# Altium project DPPXHKV1_2.PRJPCB
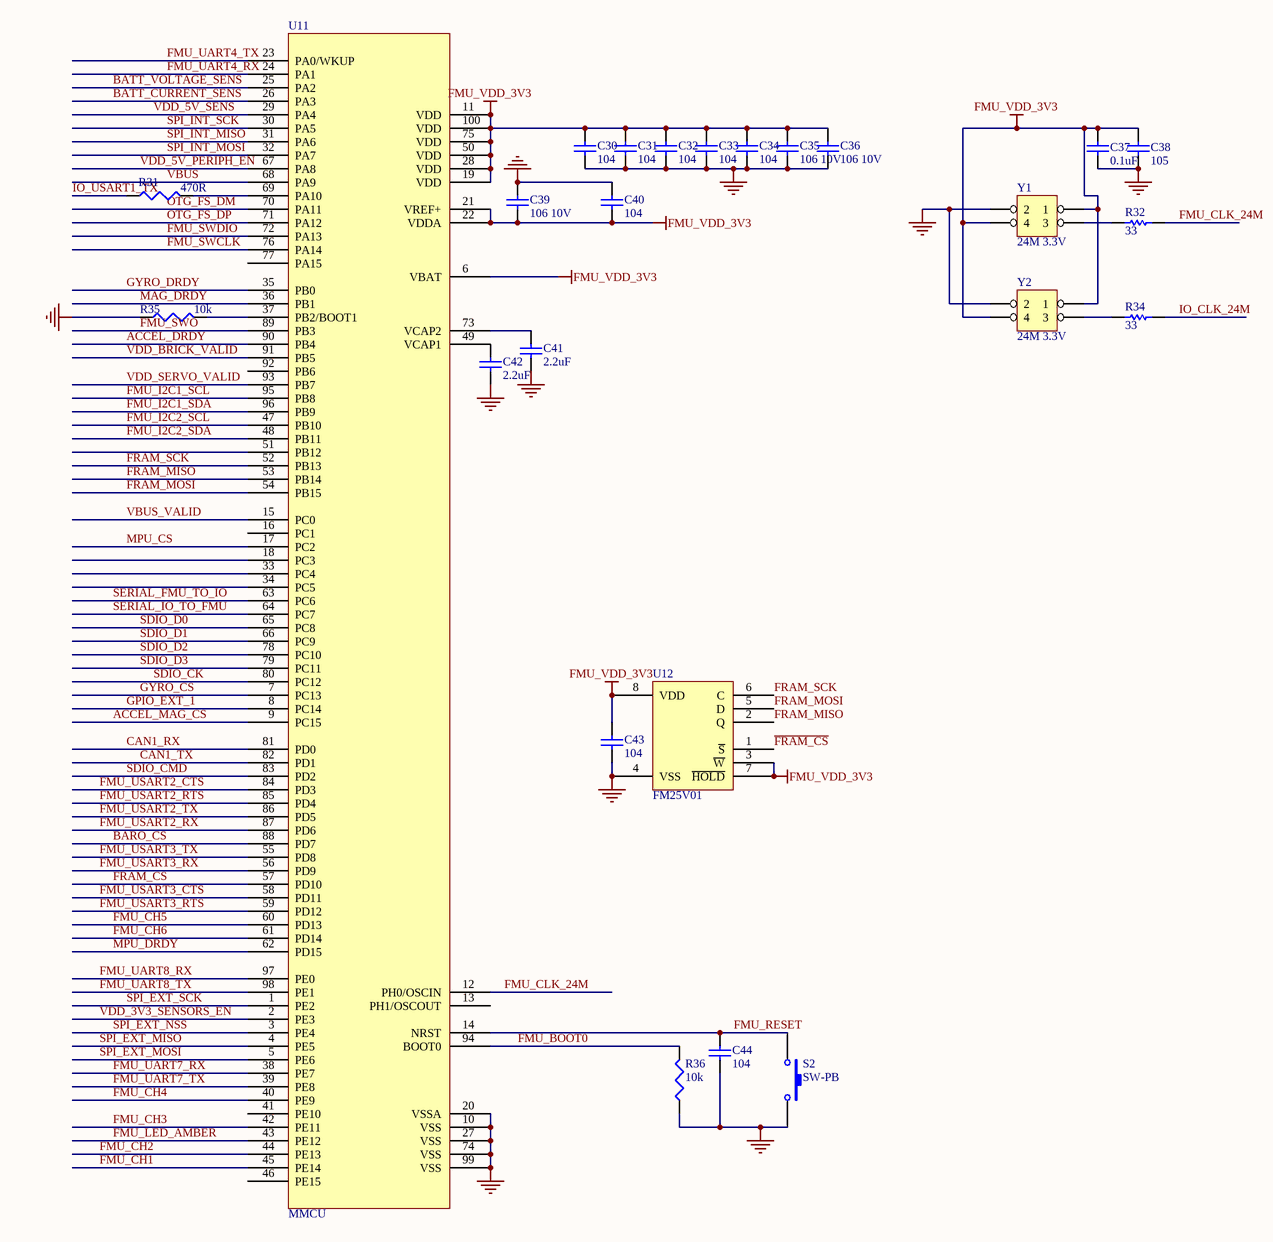
[diagram p0: DPPXHK_MCU.SchDoc]
14 sheets, 169 parts. Net scope: global (net labels, ports and power ports of the same name join across sheets).
Board file: DPPXHK.PcbDoc
Sheets:
  DPPXHK_MCU.SchDoc
  DPPXHK_IO.SCHDOC
  DPPXHK_FMUPOWER.SCHDOC
  DPPXHK_POWER_SOURCE.SCHDOC
  DPPXHK_USB_SD_DEBUG.SCHDOC
  DPPXHK_SENSOR.SCHDOC
  DPPXHK_LEDs.SCHDOC
  DPPXHK_SERVO.SCHDOC
  DPPXHK_FMU_PORTS_CAN.SCHDOC
  DPPXHK_10CL010_POWER.SchDoc
  DPPXHK_10CL010_FPGA.SchDoc
  DPPXHK_10CL010_DEBUGPORT.SchDoc
  DPPXHK_10CL010_SDRAM.SchDoc
  DPPXHK_10CL010_GRAPHICS.SchDoc

## Sheet DPPXHK_MCU.SchDoc
size A3

### Parts
C30  104  [LC0402]
C31  104  [LC0402]
C32  104  [LC0402]
C33  104  [LC0402]
C34  104  [LC0402]
C35  106 10V  [LC0402]
C36  106 10V  [LC0402]
C37  value 0.1uF  [LC0402]  (hidden comment: 104)
C38  105  [LC0402]
C39  106 10V  [LC0402]
C40  104  [LC0402]
C41  2.2uF  [LC0402]
C42  2.2uF  [LC0402]
C43  104  [LC0402]
C44  104  [LC0402]
R31  470R  [0402R]
R32  value 33  [0402R]  (hidden comment: 33R)
R34  value 33  [0402R]  (hidden comment: 33R)
R35  10k  [0402R]
R36  10k  [0402R]
S2  SW-PB  [BUTTON-3*6]
U11  MMCU  [LQFP100st]
U12  FM25V01  [SO-g8]
Y1  24M 3.3V  [OSCILLATOR-3.2X2.5]
Y2  24M 3.3V  [OSCILLATOR-3.2X2.5]

### Nets
BATT_CURRENT_SENS: U11.26(PA3)
BATT_VOLTAGE_SENS: U11.25(PA2)
FMU_VDD_3V3: C30.1 C31.1 C32.1 C33.1 C34.1 C35.1 C36.1 C37.2 C38.2 C39.2 C40.2 C43.2 U11.6(VBAT) U11.11(VDD) U11.19(VDD) U11.21(VREF+) U11.22(VDDA) U11.28(VDD) U11.50(VDD) U11.75(VDD) U11.100(VDD) U12.3(~{W}) U12.7(~{HOLD}) U12.8(VDD) Y1.1 Y1.4 Y2.1 Y2.4  [project net IO_VDD_3V3]
GND: C30.2 C31.2 C32.2 C33.2 C34.2 C35.2 C36.2 C37.1 C38.1 C39.1 C40.1 C41.2 C42.2 C43.1 C44.1 R35.1 R36.1 S2.2 U11.10(VSS) U11.20(VSSA) U11.27(VSS) U11.74(VSS) U11.99(VSS) U12.4(VSS) Y1.2 Y2.2
VBUS: U11.68(PA9)
~{FRAM_CS}: U11.57(PD10) U12.1(~{S})
ACCEL_DRDY: U11.90(PB4)
ACCEL_MAG_CS: U11.9(PC15)
BARO_CS: U11.88(PD7)
CAN1_RX: U11.81(PD0)
CAN1_TX: U11.82(PD1)
FMU_BOOT0: R36.2 U11.94(BOOT0)
FMU_CH1: U11.45(PE14)  [project net AUX_OUT1]
FMU_CH2: U11.44(PE13)  [project net AUX_OUT2]
FMU_CH3: U11.42(PE11)  [project net AUX_OUT3]
FMU_CH4: U11.40(PE9)  [project net AUX_OUT4]
FMU_CH5: U11.60(PD13)  [project net AUX_OUT5]
FMU_CH6: U11.61(PD14)  [project net AUX_OUT6]
FMU_CLK_24M: R32.2 U11.12(PH0/OSCIN)
FMU_I2C1_SCL: U11.95(PB8)
FMU_I2C1_SDA: U11.96(PB9)
FMU_I2C2_SCL: U11.47(PB10)
FMU_I2C2_SDA: U11.48(PB11)
FMU_LED_AMBER: U11.43(PE12)
FMU_RESET: C44.2 S2.1 U11.14(NRST)
FMU_SWCLK: U11.76(PA14)
FMU_SWDIO: U11.72(PA13)
FMU_SWO: U11.89(PB3)
FMU_UART4_RX: U11.24(PA1)
FMU_UART4_TX: U11.23(PA0/WKUP)
FMU_UART7_RX: U11.38(PE7)
FMU_UART7_TX: U11.39(PE8)
FMU_UART8_RX: U11.97(PE0)
FMU_UART8_TX: U11.98(PE1)
FMU_USART2_CTS: U11.84(PD3)
FMU_USART2_RTS: U11.85(PD4)
FMU_USART2_RX: U11.87(PD6)
FMU_USART2_TX: U11.86(PD5)
FMU_USART3_CTS: U11.58(PD11)
FMU_USART3_RTS: U11.59(PD12)
FMU_USART3_RX: U11.56(PD9)
FMU_USART3_TX: U11.55(PD8)
FRAM_MISO: U11.53(PB14) U12.2(Q)
FRAM_MOSI: U11.54(PB15) U12.5(D)
FRAM_SCK: U11.52(PB13) U12.6(C)
GPIO_EXT_1: U11.8(PC14)
GYRO_CS: U11.7(PC13)
GYRO_DRDY: U11.35(PB0)
IO_CLK_24M: R34.2
IO_USART1_TX: R31.1
MAG_DRDY: U11.36(PB1)
MPU_CS: U11.17(PC2)
MPU_DRDY: U11.62(PD15)
OTG_FS_DM: U11.70(PA11)
OTG_FS_DP: U11.71(PA12)
SDIO_CK: U11.80(PC12)
SDIO_CMD: U11.83(PD2)
SDIO_D0: U11.65(PC8)
SDIO_D1: U11.66(PC9)
SDIO_D2: U11.78(PC10)
SDIO_D3: U11.79(PC11)
SERIAL_FMU_TO_IO: U11.63(PC6)
SERIAL_IO_TO_FMU: U11.64(PC7)
SPI_EXT_MISO: U11.4(PE5)
SPI_EXT_MOSI: U11.5(PE6)
SPI_EXT_NSS: U11.3(PE4)
SPI_EXT_SCK: U11.1(PE2)
SPI_INT_MISO: U11.31(PA6)
SPI_INT_MOSI: U11.32(PA7)
SPI_INT_SCK: U11.30(PA5)
VBUS_VALID: U11.15(PC0)
VDD_3V3_SENSORS_EN: U11.2(PE3)
VDD_5V_PERIPH_EN: U11.67(PA8)
VDD_5V_SENS: U11.29(PA4)
VDD_BRICK_VALID: U11.91(PB5)
VDD_SERVO_VALID: U11.93(PB7)
NetC41_1: C41.1 U11.73(VCAP2)
NetC42_1: C42.1 U11.49(VCAP1)
NetR31_2: R31.2 U11.69(PA10)
NetR32_1: R32.1 Y1.3
NetR34_1: R34.1 Y2.3
NetR35_2: R35.2 U11.37(PB2/BOOT1)

Not connected (* = marked no-connect by the designer): U11 13(PH1/OSCOUT) 16(PC1) 18(PC3) 33(PC4) 34(PC5) 41(PE10) 46(PE15) 51(PB12) 77(PA15) 92(PB6)

### Library data of the parts
C30-C44 = Cap Semi: Capacitor (Semiconductor SIM Model); Published: 8-Jun-2000; Publisher: Altium Limited
  C30-C36 C39-C44: LatestRevisionDate: 17-Jul-2002; LatestRevisionNote: Re-released for DXP Platform.; PackageReference: C1206
  C37: Revision: July-2002: Re-released for DXP Platform.
  C38: Revision: July-2002: Re-released for DXP Platform.; Value: 105
R31 R35 R36 = Res3: Resistor; Published: 8-Jun-2000; LatestRevisionDate: 4-Mar-2005; LatestRevisionNote: PCB Footprint replaced.; Publisher: Altium Limited
R32 R34 = Res1: Resistor; Manufacturer: Generic Components; Class: Passive; Published: 08/06/2000; Publisher: Altium Hobart Technology Centre; SubClass: Resistor
S2 = SW-PB: Switch; Published: 24-Mar-1999; LatestRevisionDate: 17-Jul-2002; LatestRevisionNote: Re-released for DXP Platform.; Publisher: Altium Limited
U11 = F4x7
Y1 Y2 = HEADER 2X2

## Sheet DPPXHK_IO.SCHDOC
size A4
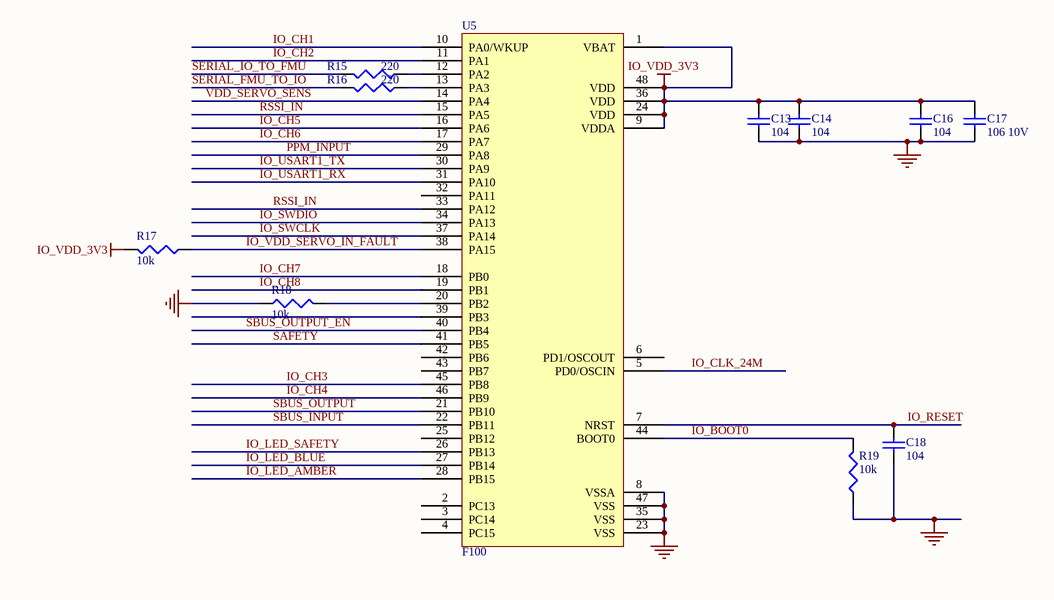
[diagram p1: DPPXHK_IO.SCHDOC]

### Parts
C13  104  [LC0402]
C14  104  [LC0402]
C16  104  [LC0402]
C17  106 10V  [LC0402]
C18  104  [LC0402]
R15  220  [0402R]
R16  220  [0402R]
R17  10k  [0402R]
R18  10k  [0402R]
R19  10k  [0402R]
U5  F100  [LQFP48_ST]

### Nets
GND: C13.2 C14.2 C16.2 C17.2 C18.1 R18.1 R19.1 U5.8(VSSA) U5.23(VSS) U5.35(VSS) U5.47(VSS)
IO_VDD_3V3: C13.1 C14.1 C16.1 C17.1 R17.2 U5.1(VBAT) U5.9(VDDA) U5.24(VDD) U5.36(VDD) U5.48(VDD)
IO_BOOT0: R19.2 U5.44(BOOT0)
IO_CH1: U5.10(PA0/WKUP)
IO_CH2: U5.11(PA1)
IO_CH3: U5.45(PB8)
IO_CH4: U5.46(PB9)
IO_CH5: U5.16(PA6)
IO_CH6: U5.17(PA7)
IO_CH7: U5.18(PB0)
IO_CH8: U5.19(PB1)
IO_CLK_24M: U5.5(PD0/OSCIN)
IO_LED_AMBER: U5.28(PB15)
IO_LED_BLUE: U5.27(PB14)
IO_LED_SAFETY: U5.26(PB13)
IO_RESET: C18.2 U5.7(NRST)
IO_SWCLK: U5.37(PA14)
IO_SWDIO: U5.34(PA13)
IO_USART1_RX: U5.31(PA10)
IO_USART1_TX: U5.30(PA9)
IO_VDD_SERVO_IN_FAULT: R17.1 U5.38(PA15)
PPM_INPUT: U5.29(PA8)
RSSI_IN: U5.15(PA5) U5.33(PA12)
SAFETY: U5.41(PB5)
SBUS_INPUT: U5.22(PB11)
SBUS_OUTPUT: U5.21(PB10)
SBUS_OUTPUT_EN: U5.40(PB4)
SERIAL_FMU_TO_IO: R16.2
SERIAL_IO_TO_FMU: R15.2
VDD_SERVO_SENS: U5.14(PA4)
NetR15_1: R15.1 U5.12(PA2)
NetR16_1: R16.1 U5.13(PA3)
NetR18_2: R18.2 U5.20(PB2)

Not connected (* = marked no-connect by the designer): U5 2(PC13) 3(PC14) 4(PC15) 6(PD1/OSCOUT) 25(PB12) 32(PA11) 39(PB3) 42(PB6) 43(PB7)

### Library data of the parts
C13 C14 C16-C18 = Cap Semi: Capacitor (Semiconductor SIM Model); Published: 8-Jun-2000; LatestRevisionDate: 17-Jul-2002; LatestRevisionNote: Re-released for DXP Platform.; PackageReference: C1206; Publisher: Altium Limited
R15-R19 = Res3: Resistor; Published: 8-Jun-2000; LatestRevisionDate: 4-Mar-2005; LatestRevisionNote: PCB Footprint replaced.; Publisher: Altium Limited

## Sheet DPPXHK_FMUPOWER.SCHDOC
size A4
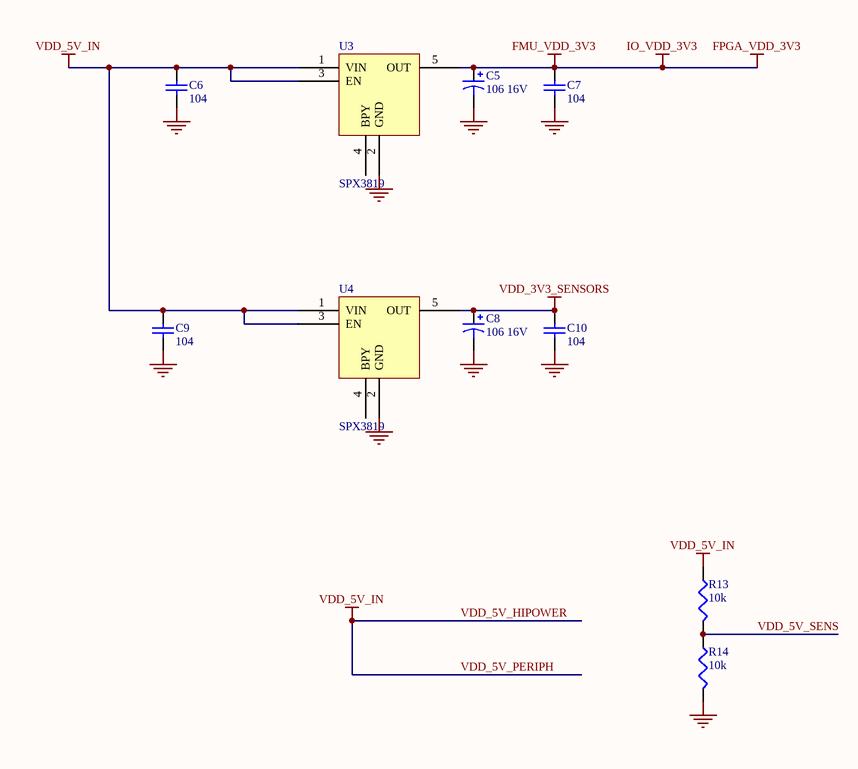
[diagram p2: DPPXHK_FMUPOWER.SCHDOC]

### Parts
C5  106 16V  [LC0402]
C6  104  [LC0402]
C7  104  [LC0402]
C8  106 16V  [LC0402]
C9  104  [LC0402]
C10  104  [LC0402]
R13  10k  [0402R]
R14  10k  [0402R]
U3  SPX3819  [SOT-23-5]
U4  SPX3819  [SOT-23-5]

### Nets
GND: C5.2 C6.1 C7.1 C8.2 C9.1 C10.1 R14.2 U3.2(GND) U4.2(GND)
IO_VDD_3V3: C5.1 C7.2 U3.5(OUT)  [also labelled FMU_VDD_3V3, FPGA_VDD_3V3]
VDD_3V3_SENSORS: C8.1 C10.2 U4.5(OUT)
VDD_5V_HIPOWER: C6.2 C9.2 R13.1 U3.1(VIN) U3.3(EN) U4.1(VIN) U4.3(EN)  [also labelled VDD_5V_IN, VDD_5V_PERIPH]
VDD_5V_SENS: R13.2 R14.1

Not connected (* = marked no-connect by the designer): U3 4(BPY); U4 4(BPY)

### Library data of the parts
C5 C8 = Cap Pol3: Polarized Capacitor (Surface Mount); Published: 8-Jun-2000; LatestRevisionDate: 17-Jul-2002; LatestRevisionNote: Re-released for DXP Platform.; PackageReference: C0805; Publisher: Altium Limited
C6 C7 C9 C10 = Cap Semi: Capacitor (Semiconductor SIM Model); Published: 8-Jun-2000; LatestRevisionDate: 17-Jul-2002; LatestRevisionNote: Re-released for DXP Platform.; PackageReference: C1206; Publisher: Altium Limited
R13 R14 = Res3: Resistor; Published: 8-Jun-2000; LatestRevisionDate: 4-Mar-2005; LatestRevisionNote: PCB Footprint replaced.; Publisher: Altium Limited

## Sheet DPPXHK_POWER_SOURCE.SCHDOC
size A4
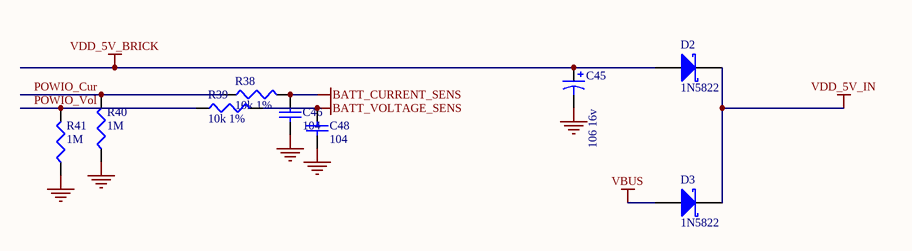
[diagram p3: DPPXHK_POWER_SOURCE.SCHDOC]

### Parts
C45  106 16v  [LC0402]
C46  104  [LC0402]
C48  104  [LC0402]
D2  1N5822  [SMA]
D3  1N5822  [SMA]
R38  10k 1%  [0402R]
R39  10k 1%  [0402R]
R40  1M  [0402R]
R41  1M  [0402R]

### Nets
BATT_CURRENT_SENS: C46.2 R38.2
BATT_VOLTAGE_SENS: C48.2 R39.2
GND: C45.2 C46.1 C48.1 R40.1 R41.1
VBUS: D3.1(A)
VDD_5V_BRICK: C45.1 D2.1(A)
VDD_5V_IN: D2.2(K) D3.2(K)  [project net VDD_5V_HIPOWER]
POWIO_Cur: R38.1 R40.2
POWIO_Vol: R39.1 R41.2

### Library data of the parts
C45 = Cap Pol3: Polarized Capacitor (Surface Mount); Published: 8-Jun-2000; LatestRevisionDate: 17-Jul-2002; LatestRevisionNote: Re-released for DXP Platform.; PackageReference: C0805; Publisher: Altium Limited
C46 C48 = Cap: Capacitor; Published: 8-Jun-2000; LatestRevisionDate: 17-Jul-2002; LatestRevisionNote: Re-released for DXP Platform.; Publisher: Altium Limited
D2 D3 = D Schottky: Schottky Diode; pin to pad: 1>2 2>1; Published: 8-Jun-2000; LatestRevisionDate: 17-Jul-2002; LatestRevisionNote: Re-released for DXP Platform.; PackageReference: SMB; Publisher: Altium Limited; Code_JEDEC: DO-214-AA
R38-R41 = Res3: Resistor; Published: 8-Jun-2000; LatestRevisionDate: 4-Mar-2005; LatestRevisionNote: PCB Footprint replaced.; Publisher: Altium Limited

## Sheet DPPXHK_USB_SD_DEBUG.SCHDOC
size A4
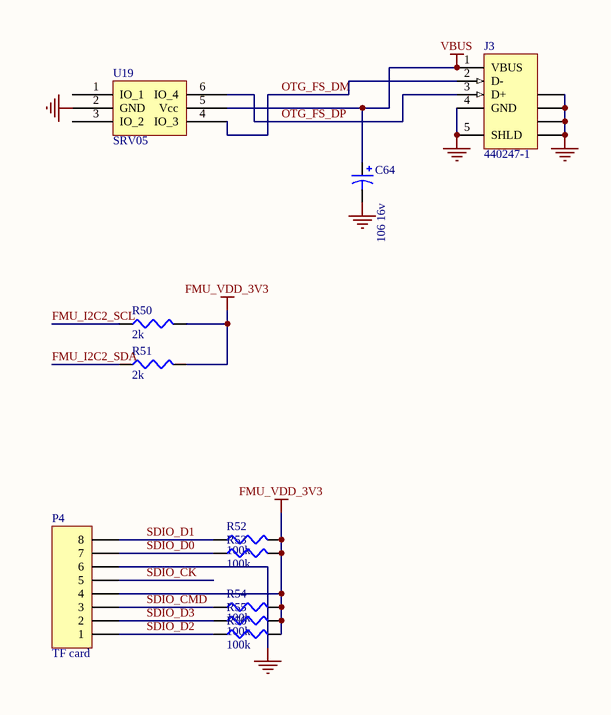
[diagram p4: DPPXHK_USB_SD_DEBUG.SCHDOC]

### Parts
C64  106 16v  [LC0402]
J3  440247-1  [MCRO_USB]
P4  TF card  [TF-2]
R50  2k  [0402R]
R51  2k  [0402R]
R52  100k  [0402R]
R53  100k  [0402R]
R54  100k  [0402R]
R55  100k  [0402R]
R56  100k  [0402R]
U19  SRV05  [SOT23-6]

### Nets
FMU_VDD_3V3: P4.4 R50.2 R51.2 R52.2 R53.2 R54.2 R55.2 R56.2  [project net IO_VDD_3V3]
GND: C64.2 J3.4(GND) J3.5(SHLD) J3.6(SHLD) J3.7(SHLD) J3.8(SHLD) J3.9(SHLD) P4.6 U19.2(GND)
VBUS: C64.1 J3.1(VBUS) U19.5(Vcc)
FMU_I2C2_SCL: R50.1
FMU_I2C2_SDA: R51.1
OTG_FS_DM: J3.2(D-) U19.4(IO_3)
OTG_FS_DP: J3.3(D+) U19.6(IO_4)
SDIO_CK: P4.5
SDIO_CMD: P4.3 R54.1
SDIO_D0: P4.7 R53.1
SDIO_D1: P4.8 R52.1
SDIO_D2: P4.1 R56.1
SDIO_D3: P4.2 R55.1

Not connected (* = marked no-connect by the designer): U19 1(IO_1) 3(IO_2)

### Library data of the parts
C64 = Cap Pol3: Polarized Capacitor (Surface Mount); Published: 8-Jun-2000; LatestRevisionDate: 17-Jul-2002; LatestRevisionNote: Re-released for DXP Platform.; PackageReference: C0805; Publisher: Altium Limited
J3 = 440247-1: USB 2.0, Right Angle, SMT, B Type, Receptacle, 5 Position, Black; ContactMaterial: Copper Alloy; ContactPlating: Gold (30); PCB_Layout: Complies with manufacturer's recommendation.; DrillSize: Corresponds to nominal value.; PanelGround: Without; Published: 15-Jul-2004; DatasheetDocument: 27-Jun-2003; PackageDocument: 27-Jun-2003; PackageReference: 440247; Publisher: Altium Limited; ComponentLink1Description: Manufacturer Link; ComponentLink1URL: http://www.tycoelectronics.com/; HousingMaterial: Thermoplastic
P4 = Header 8: Header, 8-Pin; LatestRevisionDate: 17-Jul-2002; LatestRevisionNote: Re-released for DXP Platform.; Publisher: Altium Limited
R50-R56 = Res3: Resistor; Published: 8-Jun-2000; LatestRevisionDate: 4-Mar-2005; LatestRevisionNote: PCB Footprint replaced.; Publisher: Altium Limited

## Sheet DPPXHK_SENSOR.SCHDOC
size A4
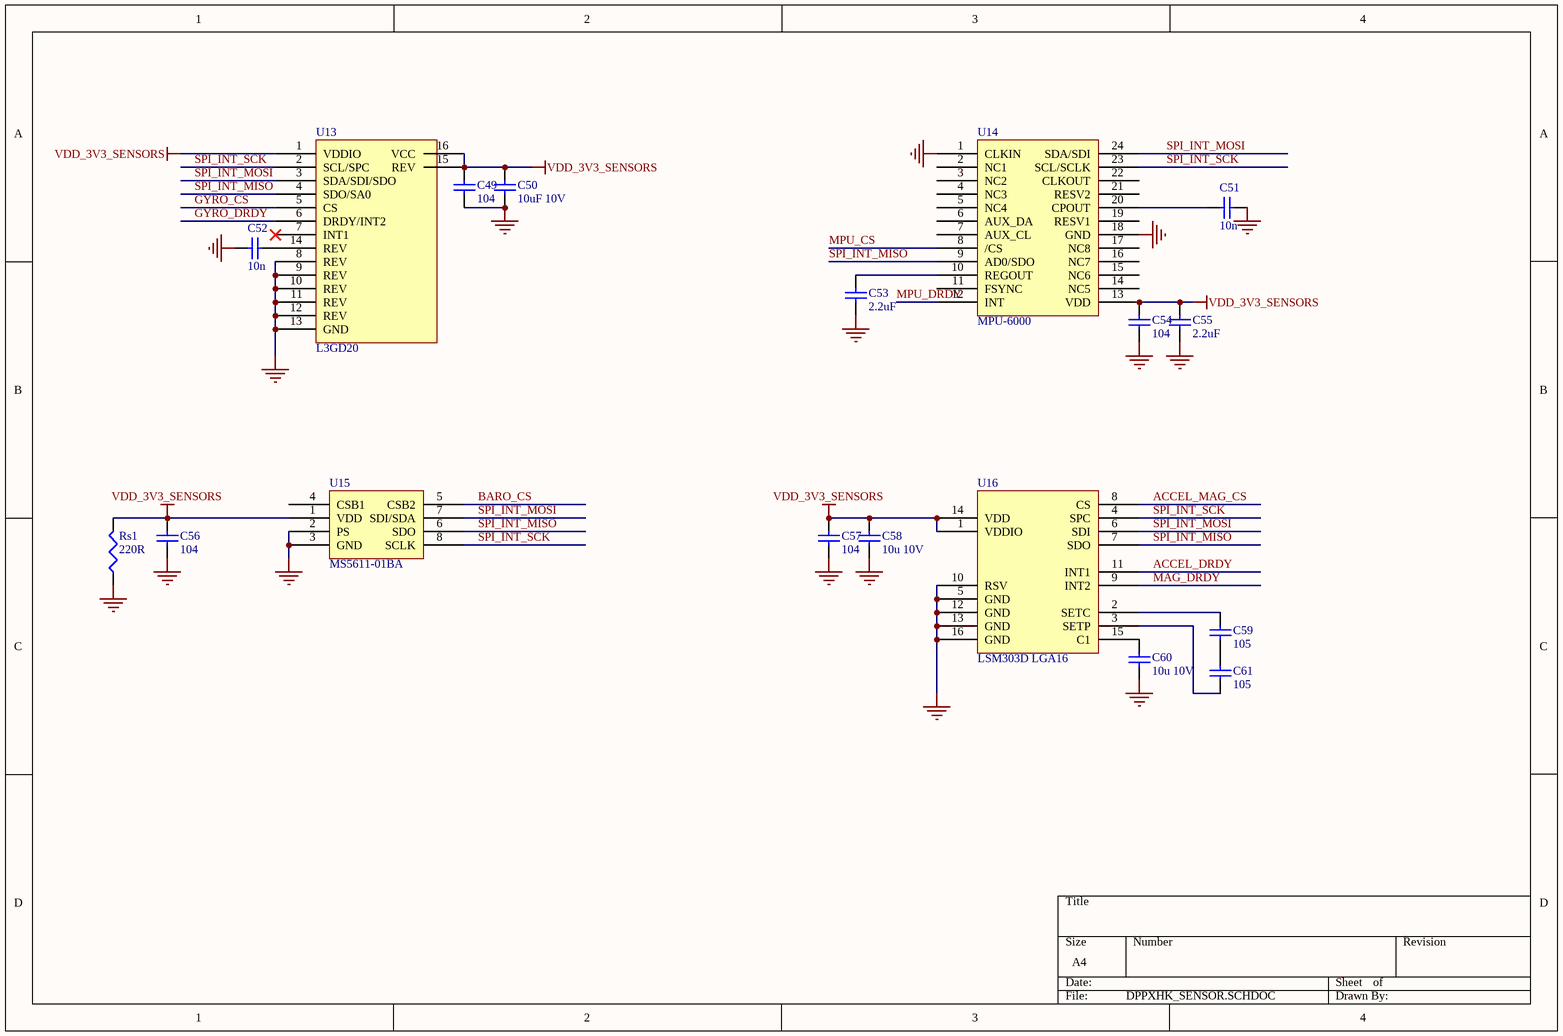
[diagram p5: DPPXHK_SENSOR.SCHDOC]

### Parts
C49  104  [LC0402]
C50  10uF 10V  [LC0402]
C51  10n  [LC0402]
C52  10n  [LC0402]
C53  2.2uF  [LC0402]
C54  104  [LC0402]
C55  2.2uF  [LC0402]
C56  104  [LC0402]
C57  104  [LC0402]
C58  10u 10V  [LC0402]
C59  105  [LC0402]
C60  10u 10V  [LC0402]
C61  105  [LC0402]
Rs1  220R  [0402R]
U13  L3GD20  [LGA_16]
U14  MPU-6000  [MPU_FP]
U15  MS5611-01BA  [MS5611-01]
U16  LSM303D LGA16  [LGA_3_3_16L]

### Nets
GND: C49.1 C50.1 C51.1 C52.1 C53.1 C54.1 C55.1 C56.1 C57.1 C58.1 C60.1 Rs1.1 U13.8(REV) U13.9(REV) U13.10(REV) U13.11(REV) U13.12(REV) U13.13(GND) U14.1(CLKIN) U14.18(GND) U15.2(PS) U15.3(GND) U16.5(GND) U16.10(RSV) U16.12(GND) U16.13(GND) U16.16(GND)
VDD_3V3_SENSORS: C49.2 C50.2 C54.2 C55.2 C56.2 C57.2 C58.2 Rs1.2 U13.1(VDDIO) U13.15(REV) U13.16(VCC) U14.13(VDD) U15.1(VDD) U16.1(VDDIO) U16.14(VDD)
ACCEL_DRDY: U16.11(INT1)
ACCEL_MAG_CS: U16.8(CS)
BARO_CS: U15.5(CSB2)
GYRO_CS: U13.5(CS)
GYRO_DRDY: U13.6(DRDY/INT2)
MAG_DRDY: U16.9(INT2)
MPU_CS: U14.8(/CS)
MPU_DRDY: U14.12(INT)
SPI_INT_MISO: U13.4(SDO/SA0) U14.9(AD0/SDO) U15.6(SDO) U16.7(SDO)
SPI_INT_MOSI: U13.3(SDA/SDI/SDO) U14.24(SDA/SDI) U15.7(SDI/SDA) U16.6(SDI)
SPI_INT_SCK: U13.2(SCL/SPC) U14.23(SCL/SCLK) U15.8(SCLK) U16.4(SPC)
NetC51_2: C51.2 U14.20(CPOUT)
NetC52_2: C52.2 U13.14(REV)
NetC53_2: C53.2 U14.10(REGOUT)
NetC59_1: C59.1 C61.2
NetC59_2: C59.2 U16.2(SETC)
NetC60_2: C60.2 U16.15(C1)
NetC61_1: C61.1 U16.3(SETP)

Not connected (* = marked no-connect by the designer): U13 7(INT1)*; U14 2(NC1) 3(NC2) 4(NC3) 5(NC4) 6(AUX_DA) 7(AUX_CL) 11(FSYNC) 14(NC5) 15(NC6) 16(NC7) 17(NC8) 19(RESV1) 21(RESV2) 22(CLKOUT); U15 4(CSB1)

### Library data of the parts
C49-C61 = Cap Semi: Capacitor (Semiconductor SIM Model); Published: 8-Jun-2000; LatestRevisionDate: 17-Jul-2002; LatestRevisionNote: Re-released for DXP Platform.; PackageReference: C1206; Publisher: Altium Limited
Rs1 = Res3: Resistor; Published: 8-Jun-2000; LatestRevisionDate: 4-Mar-2005; LatestRevisionNote: PCB Footprint replaced.; Publisher: Altium Limited

## Sheet DPPXHK_LEDs.SCHDOC
size A4
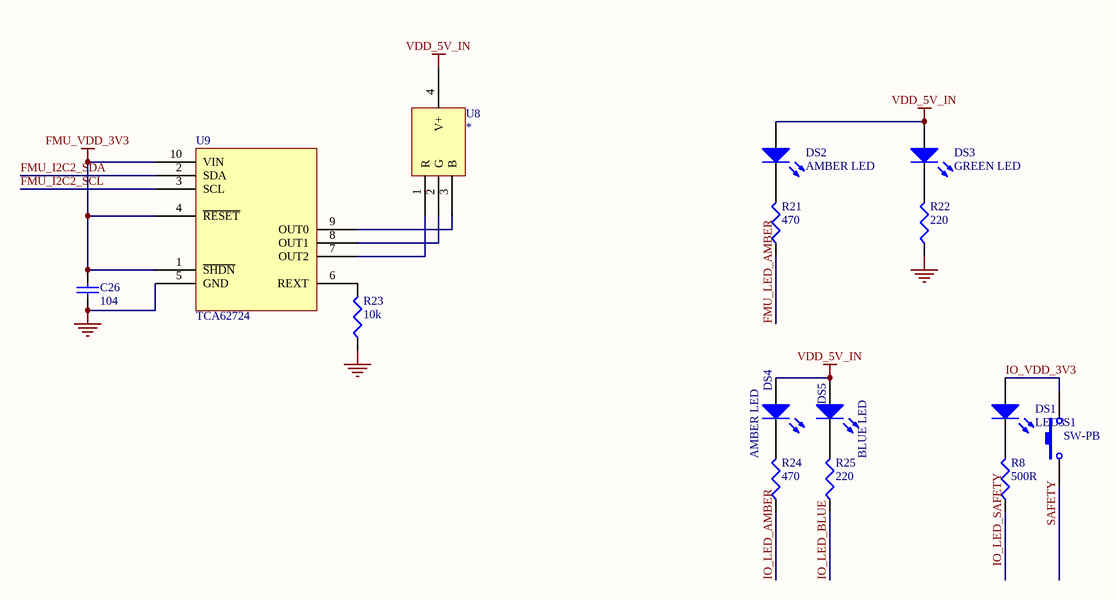
[diagram p6: DPPXHK_LEDs.SCHDOC]

### Parts
C26  104  [LC0402]
DS1  LED3  [0603_diode]
DS2  AMBER LED  [0603_diode]
DS3  GREEN LED  [0603_diode]
DS4  AMBER LED  [0603_diode]
DS5  BLUE LED  [0603_diode]
R8  500R  [0402R]
R21  470  [0402R]
R22  220  [0402R]
R23  10k  [0402R]
R24  470  [0402R]
R25  220  [0402R]
S1  SW-PB  [BUTTON-3*6]
U8  *  [LEDRGB]
U9  TCA62724  [SON10]

### Nets
GND: C26.1 R22.1 R23.1 U9.5(GND)
IO_VDD_3V3: C26.2 DS1.1(A) S1.2 U9.1(~{SHDN}) U9.4(~{RESET}) U9.10(VIN)  [also labelled FMU_VDD_3V3]
VDD_5V_IN: DS2.1(A) DS3.1(A) DS4.1(A) DS5.1(A) U8.4(V+)  [project net VDD_5V_HIPOWER]
FMU_I2C2_SCL: U9.3(SCL)
FMU_I2C2_SDA: U9.2(SDA)
FMU_LED_AMBER: R21.1
IO_LED_AMBER: R24.1
IO_LED_BLUE: R25.1
IO_LED_SAFETY: R8.1
SAFETY: S1.1
NetDS1_2: DS1.2(K) R8.2
NetDS2_2: DS2.2(K) R21.2
NetDS3_2: DS3.2(K) R22.2
NetDS4_2: DS4.2(K) R24.2
NetDS5_2: DS5.2(K) R25.2
NetR23_2: R23.2 U9.6(REXT)
NetU8_1: U8.1(R) U9.7(OUT2)
NetU8_2: U8.2(G) U9.8(OUT1)
NetU8_3: U8.3(B) U9.9(OUT0)

### Library data of the parts
C26 = Cap Semi: Capacitor (Semiconductor SIM Model); Published: 8-Jun-2000; LatestRevisionDate: 17-Jul-2002; LatestRevisionNote: Re-released for DXP Platform.; PackageReference: C1206; Publisher: Altium Limited
DS1-DS5 = LED3: Typical BLUE SiC LED; Published: 8-Jun-2000; LatestRevisionDate: 17-Dec-2003; LatestRevisionNote: PCB Footprint replaced.; Publisher: Altium Limited
R8 R21-R25 = Res3: Resistor; Published: 8-Jun-2000; LatestRevisionDate: 4-Mar-2005; LatestRevisionNote: PCB Footprint replaced.; Publisher: Altium Limited
S1 = SW-PB: Switch; Published: 24-Mar-1999; LatestRevisionDate: 17-Jul-2002; LatestRevisionNote: Re-released for DXP Platform.; Publisher: Altium Limited
U8 = LED_RGB

## Sheet DPPXHK_SERVO.SCHDOC
size A4
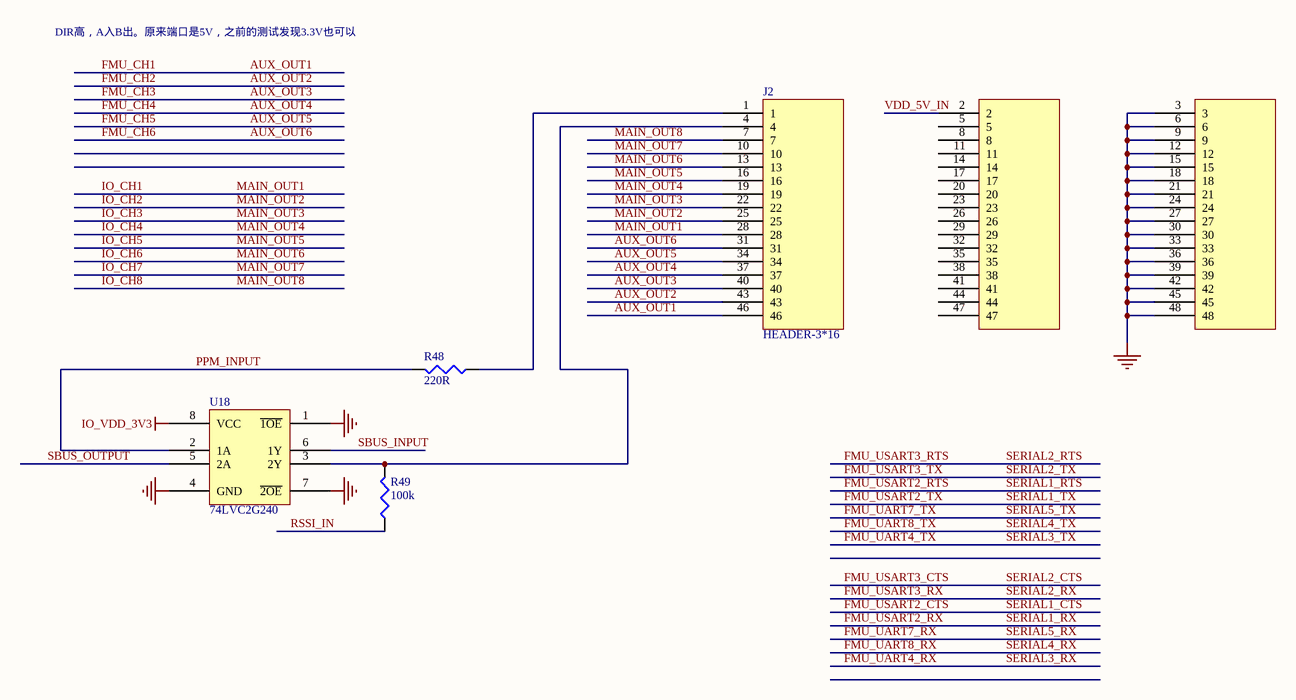
[diagram p7: DPPXHK_SERVO.SCHDOC]

### Parts
J2  HEADER-3*16  [3X16RA]
R48  220R  [0402R]
R49  100k  [0402R]
U18  74LVC2G240  [TSSOP_8]

### Nets
GND: J2.3 J2.6 J2.9 J2.12 J2.15 J2.18 J2.21 J2.24 J2.27 J2.30 J2.33 J2.36 J2.39 J2.42 J2.45 J2.48 U18.1(~{1OE}) U18.4(GND) U18.7(~{2OE})
IO_VDD_3V3: U18.8(VCC)
VDD_5V_IN: J2.2  [project net VDD_5V_HIPOWER]
AUX_OUT1: J2.46  [also labelled FMU_CH1]
AUX_OUT2: J2.43  [also labelled FMU_CH2]
AUX_OUT3: J2.40  [also labelled FMU_CH3]
AUX_OUT4: J2.37  [also labelled FMU_CH4]
AUX_OUT5: J2.34  [also labelled FMU_CH5]
AUX_OUT6: J2.31  [also labelled FMU_CH6]
IO_CH1: J2.28  [also labelled MAIN_OUT1]
IO_CH2: J2.25  [also labelled MAIN_OUT2]
IO_CH3: J2.22  [also labelled MAIN_OUT3]
IO_CH4: J2.19  [also labelled MAIN_OUT4]
IO_CH5: J2.16  [also labelled MAIN_OUT5]
IO_CH6: J2.13  [also labelled MAIN_OUT6]
IO_CH7: J2.10  [also labelled MAIN_OUT7]
IO_CH8: J2.7  [also labelled MAIN_OUT8]
PPM_INPUT: R48.2 U18.2(1A)
RSSI_IN: R49.1
SBUS_INPUT: U18.6(1Y)
SBUS_OUTPUT: U18.5(2A)
NetJ2_1: J2.1 R48.1
NetJ2_4: J2.4 R49.2 U18.3(2Y)

Not connected (* = marked no-connect by the designer): J2 5 8 11 14 17 20 23 26 29 32 35 38 41 44 47

### Notes on the sheet
- DIR高，A入B出。原来端口是5V，之前的测试发现3.3V也可以

### Library data of the parts
R48 R49 = Res3: Resistor; Published: 8-Jun-2000; LatestRevisionDate: 4-Mar-2005; LatestRevisionNote: PCB Footprint replaced.; Publisher: Altium Limited

## Sheet DPPXHK_FMU_PORTS_CAN.SCHDOC
size A4
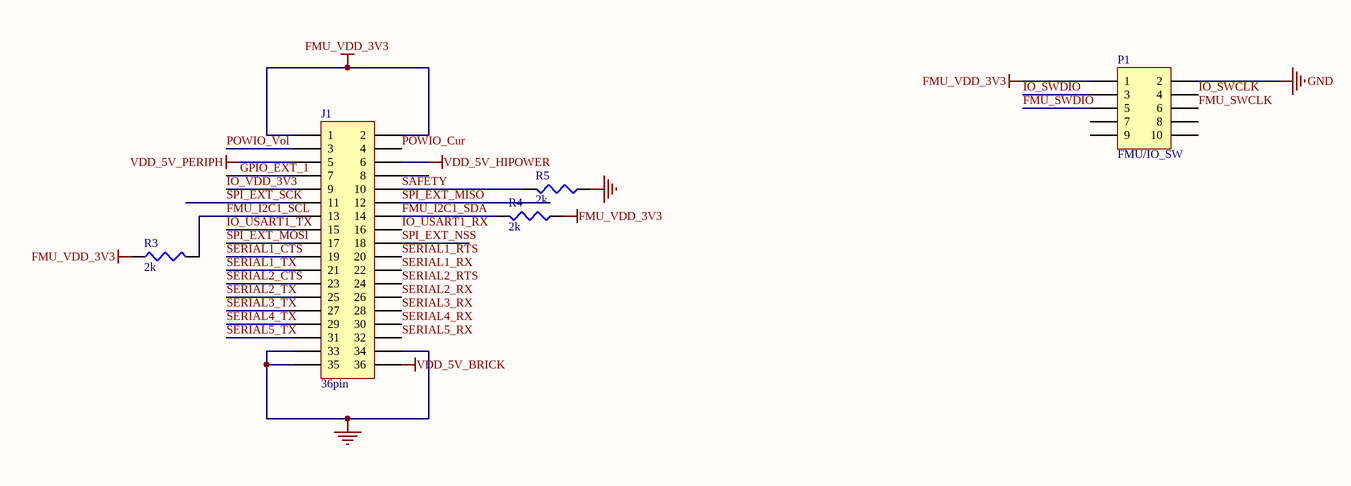
[diagram p8: DPPXHK_FMU_PORTS_CAN.SCHDOC]

### Parts
J1  36pin  [SMD-HEADER-2X20]
P1  FMU/IO_SW  [FPC-0.5-10]
R3  2k  [0402R]
R4  2k  [0402R]
R5  2k  [0402R]

### Nets
GND: J1.33 J1.34 J1.35 P1.2 R5.1
IO_VDD_3V3: J1.1 J1.2 J1.9 P1.1 R3.1 R4.1  [also labelled FMU_VDD_3V3]
VDD_5V_BRICK: J1.36
VDD_5V_HIPOWER: J1.5 J1.6  [also labelled VDD_5V_PERIPH]
FMU_I2C1_SCL: J1.13 R3.2
FMU_I2C1_SDA: J1.14 R4.2
FMU_SWCLK: P1.6
FMU_SWDIO: P1.5
GPIO_EXT_1: J1.7
IO_SWCLK: P1.4
IO_SWDIO: P1.3
IO_USART1_RX: J1.16
IO_USART1_TX: J1.15
POWIO_Cur: J1.4
POWIO_Vol: J1.3
SAFETY: J1.10 R5.2
SERIAL1_CTS: J1.19  [project net FMU_USART2_CTS]
SERIAL1_RTS: J1.20  [project net FMU_USART2_RTS]
SERIAL1_RX: J1.22  [project net FMU_USART2_RX]
SERIAL1_TX: J1.21  [project net FMU_USART2_TX]
SERIAL2_CTS: J1.23  [project net FMU_USART3_CTS]
SERIAL2_RTS: J1.24  [project net FMU_USART3_RTS]
SERIAL2_RX: J1.26  [project net FMU_USART3_RX]
SERIAL2_TX: J1.25  [project net FMU_USART3_TX]
SERIAL3_RX: J1.28  [project net FMU_UART4_RX]
SERIAL3_TX: J1.27  [project net FMU_UART4_TX]
SERIAL4_RX: J1.30  [project net FMU_UART8_RX]
SERIAL4_TX: J1.29  [project net FMU_UART8_TX]
SERIAL5_RX: J1.32  [project net FMU_UART7_RX]
SERIAL5_TX: J1.31  [project net FMU_UART7_TX]
SPI_EXT_MISO: J1.12
SPI_EXT_MOSI: J1.17
SPI_EXT_NSS: J1.18
SPI_EXT_SCK: J1.11

Not connected (* = marked no-connect by the designer): J1 8; P1 7 8 9 10

### Library data of the parts
J1 = Header 18X2: Header, 18-Pin, Dual row; LatestRevisionDate: 17-Jul-2002; LatestRevisionNote: Re-released for DXP Platform.; Publisher: Altium Limited
P1 = Header 5X2: Header, 5-Pin, Dual row; LatestRevisionDate: 17-Jul-2002; LatestRevisionNote: Re-released for DXP Platform.; Publisher: Altium Limited
R3-R5 = Res3: Resistor; Published: 8-Jun-2000; LatestRevisionDate: 4-Mar-2005; LatestRevisionNote: PCB Footprint replaced.; Publisher: Altium Limited

## Sheet DPPXHK_10CL010_POWER.SchDoc
size A4
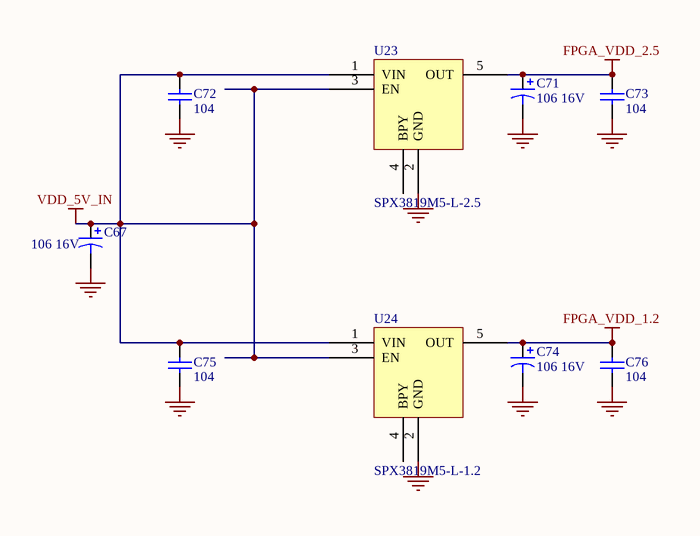
[diagram p9: DPPXHK_10CL010_POWER.SchDoc]

### Parts
C67  106 16V  [LC0402]
C71  106 16V  [LC0402]
C72  104  [LC0402]
C73  104  [LC0402]
C74  106 16V  [LC0402]
C75  104  [LC0402]
C76  104  [LC0402]
U23  SPX3819M5-L-2.5  [SOT-23-5]
U24  SPX3819M5-L-1.2  [SOT-23-5]

### Nets
FPGA_VDD_1.2: C74.1 C76.2 U24.5(OUT)
FPGA_VDD_2.5: C71.1 C73.2 U23.5(OUT)
GND: C67.2 C71.2 C72.1 C73.1 C74.2 C75.1 C76.1 U23.2(GND) U24.2(GND)
VDD_5V_IN: C67.1 C72.2 C75.2 U23.1(VIN) U23.3(EN) U24.1(VIN) U24.3(EN)  [project net VDD_5V_HIPOWER]

Not connected (* = marked no-connect by the designer): U23 4(BPY); U24 4(BPY)

### Library data of the parts
C67 C71 C74 = Cap Pol3: Polarized Capacitor (Surface Mount); Published: 8-Jun-2000; LatestRevisionDate: 17-Jul-2002; LatestRevisionNote: Re-released for DXP Platform.; PackageReference: C0805; Publisher: Altium Limited
C72 C73 C75 C76 = Cap Semi: Capacitor (Semiconductor SIM Model); Published: 8-Jun-2000; LatestRevisionDate: 17-Jul-2002; LatestRevisionNote: Re-released for DXP Platform.; PackageReference: C1206; Publisher: Altium Limited
U23 U24 = SPX3819

## Sheet DPPXHK_10CL010_FPGA.SchDoc
size A4
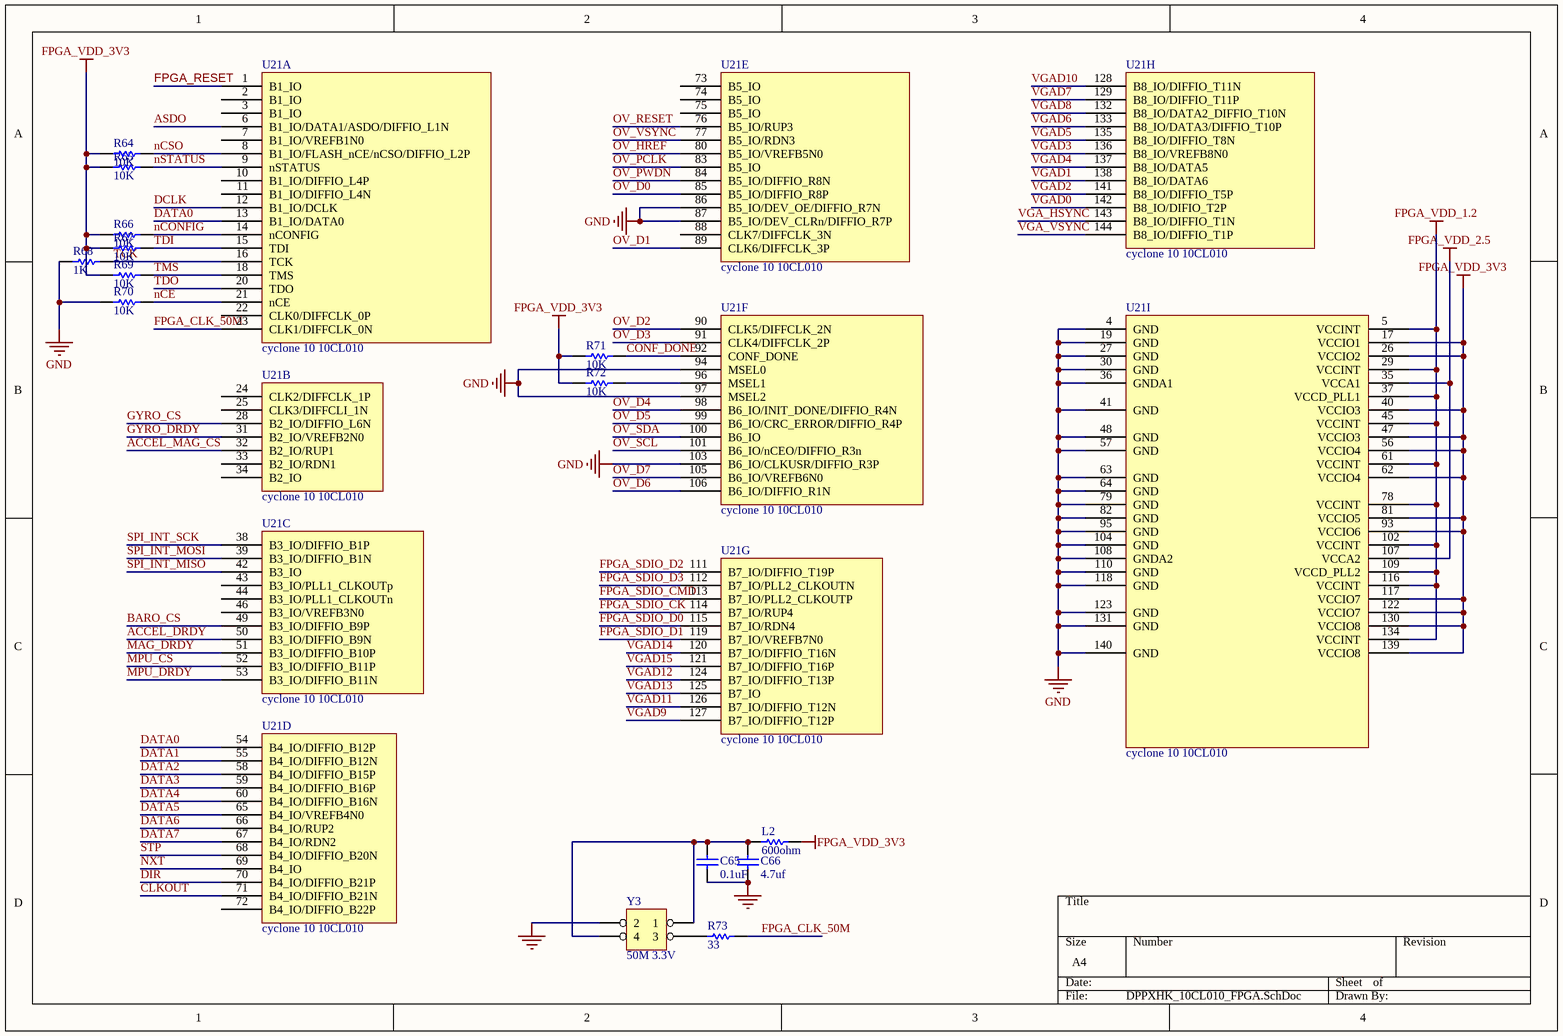
[diagram p10: DPPXHK_10CL010_FPGA.SchDoc]

### Parts
C65  value 0.1uF  [LC0402]  (hidden comment: 104)
C66  value 4.7uf  [LC0402]  (hidden comment: 105)
L2  value 600ohm  [0402R]  (hidden comment: 10K)
R64  10K  [0402R]
R65  10K  [0402R]
R66  10K  [0402R]
R67  10K  [0402R]
R68  value 1K  [0402R]  (hidden comment: 10K)
R69  10K  [0402R]
R70  10K  [0402R]
R71  10K  [0402R]
R72  10K  [0402R]
R73  value 33  [0402R]  (hidden comment: 10K)
U21  cyclone 10 10CL010  (parts A,B,C,D,E,F,G,H,I of 9)
Y3  50M 3.3V  [OSCILLATOR-3.2X2.5]

### Nets
FPGA_VDD_1.2: U21.5(VCCINT) U21.29(VCCINT) U21.37(VCCD_PLL1) U21.45(VCCINT) U21.61(VCCINT) U21.78(VCCINT) U21.102(VCCINT) U21.109(VCCD_PLL2) U21.116(VCCINT) U21.134(VCCINT)
FPGA_VDD_2.5: U21.35(VCCA1) U21.107(VCCA2)
FPGA_VDD_3V3: L2.2 R64.1 R65.1 R66.1 R67.1 R69.1 R71.1 R72.1 U21.17(VCCIO1) U21.26(VCCIO2) U21.40(VCCIO3) U21.47(VCCIO3) U21.56(VCCIO4) U21.62(VCCIO4) U21.81(VCCIO5) U21.93(VCCIO6) U21.117(VCCIO7) U21.122(VCCIO7) U21.130(VCCIO8) U21.139(VCCIO8)  [project net IO_VDD_3V3]
GND: C65.1 C66.1 R68.1 R70.1 U21.4(GND) U21.19(GND) U21.27(GND) U21.30(GND) U21.36(GNDA1) U21.41(GND) U21.48(GND) U21.57(GND) U21.63(GND) U21.64(GND) U21.79(GND) U21.82(GND) U21.86(B5_IO/DEV_OE/DIFFIO_R7N) U21.87(B5_IO/DEV_CLRn/DIFFIO_R7P) U21.94(MSEL0) U21.95(GND) U21.97(MSEL2) U21.103(B6_IO/CLKUSR/DIFFIO_R3P) U21.104(GND) U21.108(GNDA2) U21.110(GND) U21.118(GND) U21.123(GND) U21.131(GND) U21.140(GND) Y3.2
ACCEL_DRDY: U21.50(B3_IO/DIFFIO_B9N)
ACCEL_MAG_CS: U21.32(B2_IO/RUP1)
ASDO: U21.6(B1_IO/DATA1/ASDO/DIFFIO_L1N)
BARO_CS: U21.49(B3_IO/DIFFIO_B9P)
CLKOUT: U21.71(B4_IO/DIFFIO_B21N)
CONF_DONE: R71.2 U21.92(CONF_DONE)
DATA0: U21.13(B1_IO/DATA0) U21.54(B4_IO/DIFFIO_B12P)
DATA1: U21.55(B4_IO/DIFFIO_B12N)
DATA2: U21.58(B4_IO/DIFFIO_B15P)
DATA3: U21.59(B4_IO/DIFFIO_B16P)
DATA4: U21.60(B4_IO/DIFFIO_B16N)
DATA5: U21.65(B4_IO/VREFB4N0)
DATA6: U21.66(B4_IO/RUP2)
DATA7: U21.67(B4_IO/RDN2)
DCLK: U21.12(B1_IO/DCLK)
DIR: U21.70(B4_IO/DIFFIO_B21P)
FPGA_CLK_50M: R73.2 U21.23(CLK1/DIFFCLK_0N)
FPGA_RESET: U21.1(B1_IO)
FPGA_SDIO_CK: U21.114(B7_IO/RUP4)
FPGA_SDIO_CMD: U21.113(B7_IO/PLL2_CLKOUTP)
FPGA_SDIO_D0: U21.115(B7_IO/RDN4)
FPGA_SDIO_D1: U21.119(B7_IO/VREFB7N0)
FPGA_SDIO_D2: U21.111(B7_IO/DIFFIO_T19P)
FPGA_SDIO_D3: U21.112(B7_IO/PLL2_CLKOUTN)
GYRO_CS: U21.28(B2_IO/DIFFIO_L6N)
GYRO_DRDY: U21.31(B2_IO/VREFB2N0)
MAG_DRDY: U21.51(B3_IO/DIFFIO_B10P)
MPU_CS: U21.52(B3_IO/DIFFIO_B11P)
MPU_DRDY: U21.53(B3_IO/DIFFIO_B11N)
nCE: R70.2 U21.21(nCE)
nCONFIG: R66.2 U21.14(nCONFIG)
nCSO: R64.2 U21.8(B1_IO/FLASH_nCE/nCSO/DIFFIO_L2P)
nSTATUS: R65.2 U21.9(nSTATUS)
NXT: U21.69(B4_IO)
OV_D0: U21.85(B5_IO/DIFFIO_R8P)
OV_D1: U21.89(CLK6/DIFFCLK_3P)
OV_D2: U21.90(CLK5/DIFFCLK_2N)
OV_D3: U21.91(CLK4/DIFFCLK_2P)
OV_D4: U21.98(B6_IO/INIT_DONE/DIFFIO_R4N)
OV_D5: U21.99(B6_IO/CRC_ERROR/DIFFIO_R4P)
OV_D6: U21.106(B6_IO/DIFFIO_R1N)
OV_D7: U21.105(B6_IO/VREFB6N0)
OV_HREF: U21.80(B5_IO/VREFB5N0)
OV_PCLK: U21.83(B5_IO)
OV_PWDN: U21.84(B5_IO/DIFFIO_R8N)
OV_RESET: U21.76(B5_IO/RUP3)
OV_SCL: U21.101(B6_IO/nCEO/DIFFIO_R3n)
OV_SDA: U21.100(B6_IO)
OV_VSYNC: U21.77(B5_IO/RDN3)
SPI_INT_MISO: U21.42(B3_IO)
SPI_INT_MOSI: U21.39(B3_IO/DIFFIO_B1N)
SPI_INT_SCK: U21.38(B3_IO/DIFFIO_B1P)
STP: U21.68(B4_IO/DIFFIO_B20N)
TCK: R68.2 U21.16(TCK)
TDI: R67.2 U21.15(TDI)
TDO: U21.20(TDO)
TMS: R69.2 U21.18(TMS)
VGA_HSYNC: U21.143(B8_IO/DIFFIO_T1N)
VGA_VSYNC: U21.144(B8_IO/DIFFIO_T1P)
VGAD0: U21.142(B8_IO/DIFIO_T2P)
VGAD1: U21.138(B8_IO/DATA6)
VGAD2: U21.141(B8_IO/DIFFIO_T5P)
VGAD3: U21.136(B8_IO/VREFB8N0)
VGAD4: U21.137(B8_IO/DATA5)
VGAD5: U21.135(B8_IO/DIFFIO_T8N)
VGAD6: U21.133(B8_IO/DATA3/DIFFIO_T10P)
VGAD7: U21.129(B8_IO/DIFFIO_T11P)
VGAD8: U21.132(B8_IO/DATA2_DIFFIO_T10N)
VGAD9: U21.127(B7_IO/DIFFIO_T12P)
VGAD10: U21.128(B8_IO/DIFFIO_T11N)
VGAD11: U21.126(B7_IO/DIFFIO_T12N)
VGAD12: U21.124(B7_IO/DIFFIO_T13P)
VGAD13: U21.125(B7_IO)
VGAD14: U21.120(B7_IO/DIFFIO_T16N)
VGAD15: U21.121(B7_IO/DIFFIO_T16P)
NetC65_2: C65.2 C66.2 L2.1 Y3.1 Y3.4
NetR72_2: R72.2 U21.96(MSEL1)
NetR73_1: R73.1 Y3.3

Not connected (* = marked no-connect by the designer): U21 2(B1_IO) 3(B1_IO) 7(B1_IO/VREFB1N0) 10(B1_IO/DIFFIO_L4P) 11(B1_IO/DIFFIO_L4N) 22(CLK0/DIFFCLK_0P) 24(CLK2/DIFFCLK_1P) 25(CLK3/DIFFCLI_1N) 33(B2_IO/RDN1) 34(B2_IO) 43(B3_IO/PLL1_CLKOUTp) 44(B3_IO/PLL1_CLKOUTn) 46(B3_IO/VREFB3N0) 72(B4_IO/DIFFIO_B22P) 73(B5_IO) 74(B5_IO) 75(B5_IO) 88(CLK7/DIFFCLK_3N)

### Library data of the parts
C65 C66 = Cap Semi: Capacitor (Semiconductor SIM Model); Published: 8-Jun-2000; Revision: July-2002: Re-released for DXP Platform.; Publisher: Altium Limited
L2 R64-R73 = Res1: as R32 on sheet DPPXHK_MCU; Published: 08/06/2000; Publisher: Altium Hobart Technology Centre; SubClass: Resistor
  R64-R67 R69-R72: Value: 10K
U21 = 10CL010E144
Y3 = HEADER 2X2

## Sheet DPPXHK_10CL010_DEBUGPORT.SchDoc
size A4
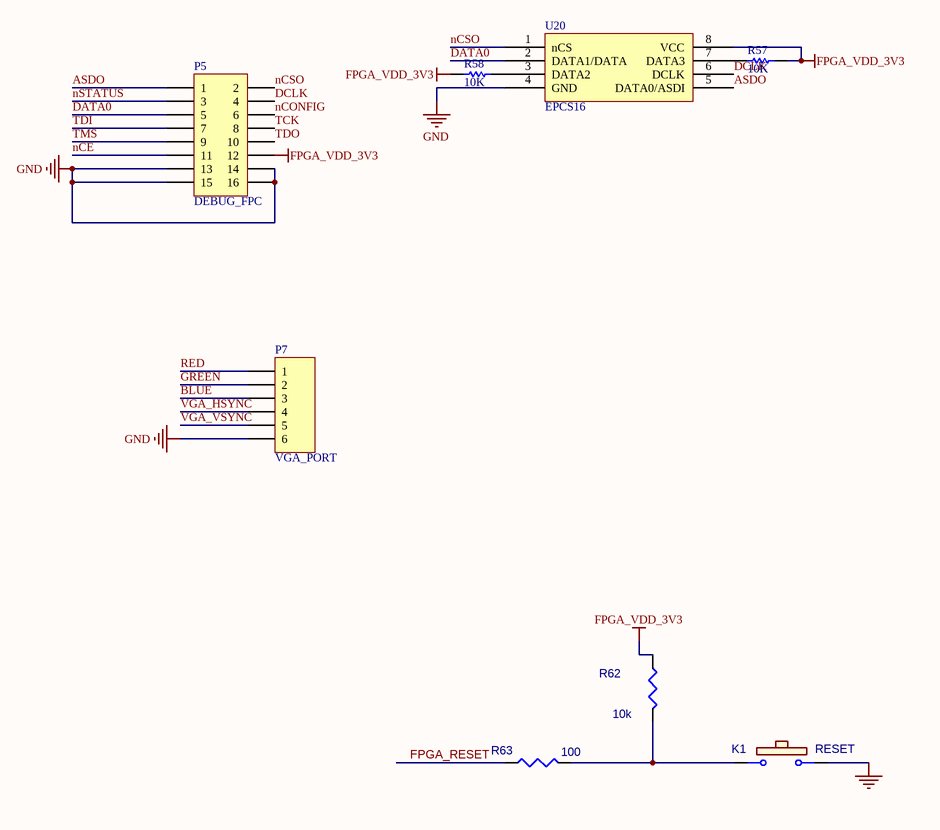
[diagram p11: DPPXHK_10CL010_DEBUGPORT.SchDoc]

### Parts
K1  RESET  [BUTTON-3*6]
P5  DEBUG_FPC  [FPC-0.5-16]
P7  VGA_PORT  [FPC-0.5-6]
R57  10K  [0402R]
R58  10K  [0402R]
R62  10k  [0402R]
R63  100  [0402R]
U20  EPCS16  [SO-g8]

### Nets
FPGA_VDD_3V3: P5.12 R57.2 R58.1 R62.1 U20.8(VCC)  [project net IO_VDD_3V3]
GND: K1.2 P5.13 P5.14 P5.15 P5.16 P7.6 U20.4(GND)
ASDO: P5.1 U20.5(DATA0/ASDI)
BLUE: P7.3
DATA0: P5.5 U20.2(DATA1/DATA)
DCLK: P5.4 U20.6(DCLK)
FPGA_RESET: R63.1
GREEN: P7.2
nCE: P5.11
nCONFIG: P5.6
nCSO: P5.2 U20.1(nCS)
nSTATUS: P5.3
RED: P7.1
TCK: P5.8
TDI: P5.7
TDO: P5.10
TMS: P5.9
VGA_HSYNC: P7.4
VGA_VSYNC: P7.5
NetK1_1: K1.1 R62.2 R63.2
NetR57_1: R57.1 U20.7(DATA3)
NetR58_2: R58.2 U20.3(DATA2)

### Library data of the parts
K1 = KEYB
P5 = Header 8X2: Header, 8-Pin, Dual row; LatestRevisionDate: 17-Jul-2002; LatestRevisionNote: Re-released for DXP Platform.; Publisher: Altium Limited
P7 = Header 6: Header, 6-Pin; LatestRevisionDate: 17-Jul-2002; LatestRevisionNote: Re-released for DXP Platform.; Publisher: Altium Limited
R57 R58 = Res1: as R32 on sheet DPPXHK_MCU; Published: 08/06/2000; Publisher: Altium Hobart Technology Centre; SubClass: Resistor; Value: 10K
R62 R63 = R_Dup2

## Sheet DPPXHK_10CL010_SDRAM.SchDoc
size A4
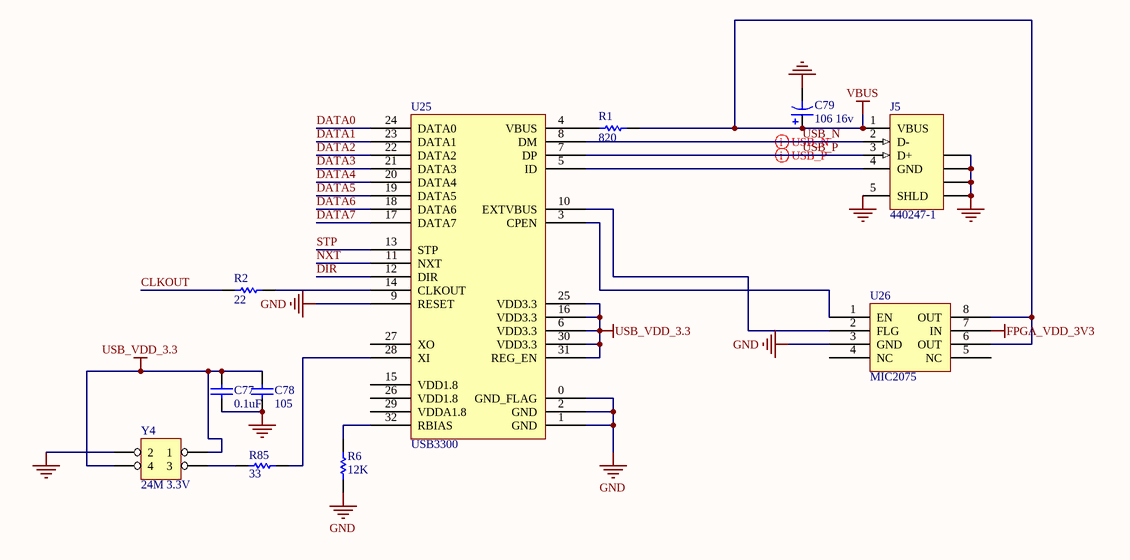
[diagram p12: DPPXHK_10CL010_SDRAM.SchDoc]

### Parts
C77  value 0.1uF  [LC0402]  (hidden comment: 104)
C78  105  [LC0402]
C79  106 16v  [LC0402]
J5  440247-1  [MCRO_USB]
R1  value 820  [0402R]  (hidden comment: 10K)
R2  value 22  [0402R]  (hidden comment: 10K)
R6  value 12K  [0402R]  (hidden comment: 10K)
R85  value 33  [0402R]  (hidden comment: 33R)
U25  USB3300  [QFN-32]
U26  MIC2075  [SOIC-8]
Y4  24M 3.3V  [OSCILLATOR-3.2X2.5]

### Nets
FPGA_VDD_3V3: U26.7(IN)  [project net IO_VDD_3V3]
GND: C77.1 C78.1 C79.2 J5.5(SHLD) J5.6(SHLD) J5.7(SHLD) J5.8(SHLD) J5.9(SHLD) R6.1 U25.0(GND_FLAG) U25.1(GND) U25.2(GND) U25.9(RESET) U26.3(GND) Y4.2
USB_VDD_3.3: C77.2 C78.2 U25.6(VDD3.3) U25.16(VDD3.3) U25.25(VDD3.3) U25.30(VDD3.3) U25.31(REG_EN) Y4.1 Y4.4
VBUS: C79.1 J5.1(VBUS) R1.1 U26.6(OUT) U26.8(OUT)
CLKOUT: R2.2
DATA0: U25.24(DATA0)
DATA1: U25.23(DATA1)
DATA2: U25.22(DATA2)
DATA3: U25.21(DATA3)
DATA4: U25.20(DATA4)
DATA5: U25.19(DATA5)
DATA6: U25.18(DATA6)
DATA7: U25.17(DATA7)
DIR: U25.12(DIR)
NXT: U25.11(NXT)
STP: U25.13(STP)
USB_N: J5.2(D-) U25.8(DM)
USB_P: J5.3(D+) U25.7(DP)
NetJ5_4: J5.4(GND) U25.5(ID)
NetR1_2: R1.2 U25.4(VBUS)
NetR2_1: R2.1 U25.14(CLKOUT)
NetR6_2: R6.2 U25.32(RBIAS)
NetR85_1: R85.1 Y4.3
NetR85_2: R85.2 U25.28(XI)
NetU25_3: U25.3(CPEN) U26.1(EN)
NetU25_10: U25.10(EXTVBUS) U26.2(FLG)

Not connected (* = marked no-connect by the designer): U25 15(VDD1.8) 26(VDD1.8) 27(XO) 29(VDDA1.8); U26 4(NC) 5(NC)

### Layout directives
differential pair: USB_N, USB_P

### Library data of the parts
C77 C78 = Cap Semi: Capacitor (Semiconductor SIM Model); Published: 8-Jun-2000; Revision: July-2002: Re-released for DXP Platform.; Publisher: Altium Limited
  C78: Value: 105
C79 = Cap Pol3: Polarized Capacitor (Surface Mount); Published: 8-Jun-2000; LatestRevisionDate: 17-Jul-2002; LatestRevisionNote: Re-released for DXP Platform.; PackageReference: C0805; Publisher: Altium Limited
J5 = 440247-1: as J3 on sheet DPPXHK_USB_SD_DEBUG; Published: 15-Jul-2004; DatasheetDocument: 27-Jun-2003; PackageDocument: 27-Jun-2003; PackageReference: 440247; Publisher: Altium Limited; ComponentLink1Description: Manufacturer Link; ComponentLink1URL: http://www.tycoelectronics.com/; HousingMaterial: Thermoplastic
R1 R2 R6 R85 = Res1: as R32 on sheet DPPXHK_MCU; Published: 08/06/2000; Publisher: Altium Hobart Technology Centre; SubClass: Resistor
Y4 = HEADER 2X2

## Sheet DPPXHK_10CL010_GRAPHICS.SchDoc
size A4
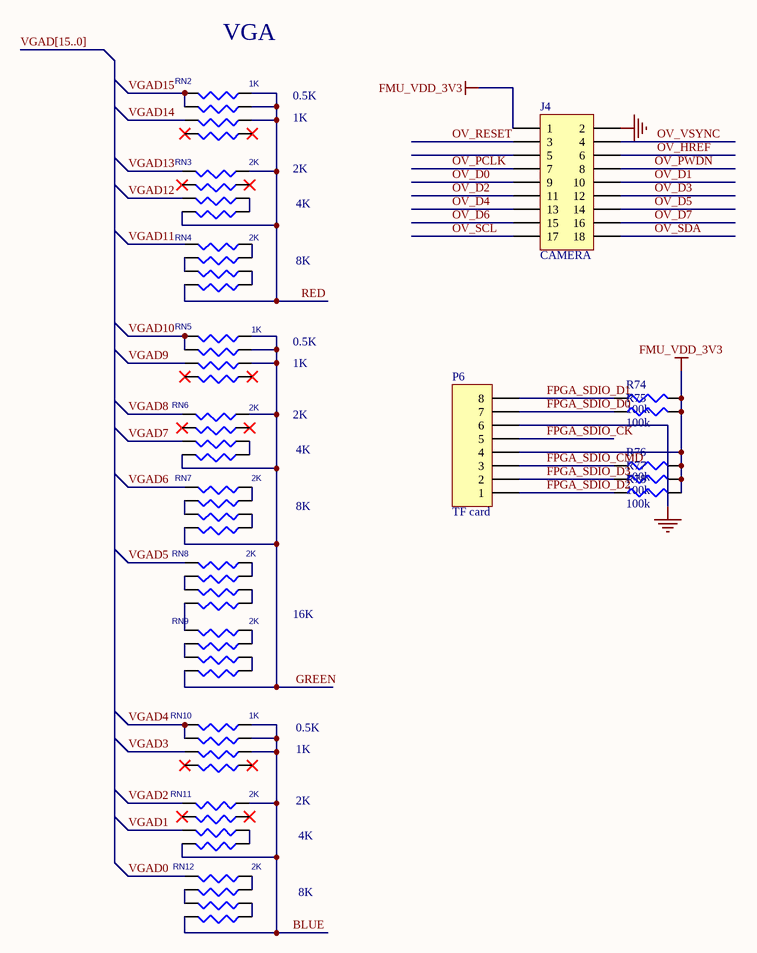
[diagram p13: DPPXHK_10CL010_GRAPHICS.SchDoc]

### Parts
J4  CAMERA  [FPC-0.5-18]
P6  TF card  [TF-2]
R74  100k  [0402R]
R75  100k  [0402R]
R76  100k  [0402R]
R77  100k  [0402R]
R78  100k  [0402R]
RN2  1K  [RN-8P]
RN3  2K  [RN-8P]
RN4  2K  [RN-8P]
RN5  1K  [RN-8P]
RN6  2K  [RN-8P]
RN7  2K  [RN-8P]
RN8  2K  [RN-8P]
RN9  2K  [RN-8P]
RN10  1K  [RN-8P]
RN11  2K  [RN-8P]
RN12  2K  [RN-8P]

### Nets
FMU_VDD_3V3: J4.1 P6.4 R74.2 R75.2 R76.2 R77.2 R78.2  [project net IO_VDD_3V3]
GND: J4.2 P6.6
BLUE: RN10.2 RN10.3 RN10.4 RN11.4 RN11.8 RN12.8
FPGA_SDIO_CK: P6.5
FPGA_SDIO_CMD: P6.3 R76.1
FPGA_SDIO_D0: P6.7 R75.1
FPGA_SDIO_D1: P6.8 R74.1
FPGA_SDIO_D2: P6.1 R78.1
FPGA_SDIO_D3: P6.2 R77.1
GREEN: RN5.2 RN5.3 RN5.4 RN6.4 RN6.8 RN7.8 RN9.8
OV_D0: J4.9
OV_D1: J4.10
OV_D2: J4.11
OV_D3: J4.12
OV_D4: J4.13
OV_D5: J4.14
OV_D6: J4.15
OV_D7: J4.16
OV_HREF: J4.6
OV_PCLK: J4.7
OV_PWDN: J4.8
OV_RESET: J4.3
OV_SCL: J4.17
OV_SDA: J4.18
OV_VSYNC: J4.4
RED: RN2.2 RN2.3 RN2.4 RN3.4 RN3.8 RN4.8
VGAD0: RN12.5
VGAD1: RN11.7
VGAD2: RN11.5
VGAD3: RN10.7
VGAD4: RN10.5 RN10.6
VGAD5: RN8.5
VGAD6: RN7.5
VGAD7: RN6.7
VGAD8: RN6.5
VGAD9: RN5.7
VGAD10: RN5.5 RN5.6
VGAD11: RN4.5
VGAD12: RN3.7
VGAD13: RN3.5
VGAD14: RN2.7
VGAD15: RN2.5 RN2.6
NetRN3_1: RN3.1 RN3.2
NetRN4_1: RN4.1 RN4.2
NetRN4_3: RN4.3 RN4.4
NetRN4_6: RN4.6 RN4.7
NetRN6_1: RN6.1 RN6.2
NetRN7_1: RN7.1 RN7.2
NetRN7_3: RN7.3 RN7.4
NetRN7_6: RN7.6 RN7.7
NetRN8_1: RN8.1 RN8.2
NetRN8_3: RN8.3 RN8.4
NetRN8_6: RN8.6 RN8.7
NetRN8_8: RN8.8 RN9.5
NetRN9_1: RN9.1 RN9.2
NetRN9_3: RN9.3 RN9.4
NetRN9_6: RN9.6 RN9.7
NetRN11_1: RN11.1 RN11.2
NetRN12_1: RN12.1 RN12.2
NetRN12_3: RN12.3 RN12.4
NetRN12_6: RN12.6 RN12.7

Not connected (* = marked no-connect by the designer): J4 5; RN2 1* 8*; RN3 3* 6*; RN5 1* 8*; RN6 3* 6*; RN10 1* 8*; RN11 3* 6*

### Buses and harness runs
bus VGAD[15..0]

### Notes on the sheet
- (near RN2) VGA
- 0.5K
- 1K
- 2K
- 4K
- 8K
- 16K

### Library data of the parts
J4 = Header 9X2: Header, 9-Pin, Dual row; LatestRevisionDate: 17-Jul-2002; LatestRevisionNote: Re-released for DXP Platform.; Publisher: Altium Limited
P6 = Header 8: Header, 8-Pin; LatestRevisionDate: 17-Jul-2002; LatestRevisionNote: Re-released for DXP Platform.; Publisher: Altium Limited
R74-R78 = Res3: Resistor; Published: 8-Jun-2000; LatestRevisionDate: 4-Mar-2005; LatestRevisionNote: PCB Footprint replaced.; Publisher: Altium Limited
RN2-RN12 = RN_Dup1

## Nets that join several sheets
BATT_CURRENT_SENS: DPPXHK_MCU (U11.26), DPPXHK_POWER_SOURCE (C46.2 R38.2)
BATT_VOLTAGE_SENS: DPPXHK_MCU (U11.25), DPPXHK_POWER_SOURCE (C48.2 R39.2)
FPGA_VDD_1.2: DPPXHK_10CL010_POWER (C74.1 C76.2 U24.5), DPPXHK_10CL010_FPGA (10 pins)
FPGA_VDD_2.5: DPPXHK_10CL010_POWER (C71.1 C73.2 U23.5), DPPXHK_10CL010_FPGA (U21.35 U21.107)
GND: DPPXHK_MCU (26 pins), DPPXHK_IO (11 pins), DPPXHK_FMUPOWER (9 pins), DPPXHK_POWER_SOURCE (5 pins), DPPXHK_USB_SD_DEBUG (9 pins), DPPXHK_SENSOR (27 pins), DPPXHK_LEDs (C26.1 R22.1 R23.1 U9.5), DPPXHK_SERVO (19 pins), DPPXHK_FMU_PORTS_CAN (5 pins), DPPXHK_10CL010_POWER (9 pins), DPPXHK_10CL010_FPGA (30 pins), DPPXHK_10CL010_DEBUGPORT (7 pins), DPPXHK_10CL010_SDRAM (15 pins), DPPXHK_10CL010_GRAPHICS (J4.2 P6.6)
IO_VDD_3V3: DPPXHK_MCU (28 pins), DPPXHK_IO (10 pins), DPPXHK_FMUPOWER (C5.1 C7.2 U3.5), DPPXHK_USB_SD_DEBUG (8 pins), DPPXHK_LEDs (6 pins), DPPXHK_SERVO (U18.8), DPPXHK_FMU_PORTS_CAN (6 pins), DPPXHK_10CL010_FPGA (20 pins), DPPXHK_10CL010_DEBUGPORT (5 pins), DPPXHK_10CL010_SDRAM (U26.7), DPPXHK_10CL010_GRAPHICS (7 pins)
VBUS: DPPXHK_MCU (U11.68), DPPXHK_POWER_SOURCE (D3.1), DPPXHK_USB_SD_DEBUG (C64.1 J3.1 U19.5), DPPXHK_10CL010_SDRAM (5 pins)
VDD_3V3_SENSORS: DPPXHK_FMUPOWER (C8.1 C10.2 U4.5), DPPXHK_SENSOR (15 pins)
VDD_5V_BRICK: DPPXHK_POWER_SOURCE (C45.1 D2.1), DPPXHK_FMU_PORTS_CAN (J1.36)
VDD_5V_HIPOWER: DPPXHK_FMUPOWER (7 pins), DPPXHK_POWER_SOURCE (D2.2 D3.2), DPPXHK_LEDs (5 pins), DPPXHK_SERVO (J2.2), DPPXHK_FMU_PORTS_CAN (J1.5 J1.6), DPPXHK_10CL010_POWER (7 pins)
ACCEL_DRDY: DPPXHK_MCU (U11.90), DPPXHK_SENSOR (U16.11), DPPXHK_10CL010_FPGA (U21.50)
ACCEL_MAG_CS: DPPXHK_MCU (U11.9), DPPXHK_SENSOR (U16.8), DPPXHK_10CL010_FPGA (U21.32)
ASDO: DPPXHK_10CL010_FPGA (U21.6), DPPXHK_10CL010_DEBUGPORT (P5.1 U20.5)
AUX_OUT1: DPPXHK_MCU (U11.45), DPPXHK_SERVO (J2.46)
AUX_OUT2: DPPXHK_MCU (U11.44), DPPXHK_SERVO (J2.43)
AUX_OUT3: DPPXHK_MCU (U11.42), DPPXHK_SERVO (J2.40)
AUX_OUT4: DPPXHK_MCU (U11.40), DPPXHK_SERVO (J2.37)
AUX_OUT5: DPPXHK_MCU (U11.60), DPPXHK_SERVO (J2.34)
AUX_OUT6: DPPXHK_MCU (U11.61), DPPXHK_SERVO (J2.31)
BARO_CS: DPPXHK_MCU (U11.88), DPPXHK_SENSOR (U15.5), DPPXHK_10CL010_FPGA (U21.49)
BLUE: DPPXHK_10CL010_DEBUGPORT (P7.3), DPPXHK_10CL010_GRAPHICS (6 pins)
CLKOUT: DPPXHK_10CL010_FPGA (U21.71), DPPXHK_10CL010_SDRAM (R2.2)
DATA0: DPPXHK_10CL010_FPGA (U21.13 U21.54), DPPXHK_10CL010_DEBUGPORT (P5.5 U20.2), DPPXHK_10CL010_SDRAM (U25.24)
DATA1: DPPXHK_10CL010_FPGA (U21.55), DPPXHK_10CL010_SDRAM (U25.23)
DATA2: DPPXHK_10CL010_FPGA (U21.58), DPPXHK_10CL010_SDRAM (U25.22)
DATA3: DPPXHK_10CL010_FPGA (U21.59), DPPXHK_10CL010_SDRAM (U25.21)
DATA4: DPPXHK_10CL010_FPGA (U21.60), DPPXHK_10CL010_SDRAM (U25.20)
DATA5: DPPXHK_10CL010_FPGA (U21.65), DPPXHK_10CL010_SDRAM (U25.19)
DATA6: DPPXHK_10CL010_FPGA (U21.66), DPPXHK_10CL010_SDRAM (U25.18)
DATA7: DPPXHK_10CL010_FPGA (U21.67), DPPXHK_10CL010_SDRAM (U25.17)
DCLK: DPPXHK_10CL010_FPGA (U21.12), DPPXHK_10CL010_DEBUGPORT (P5.4 U20.6)
DIR: DPPXHK_10CL010_FPGA (U21.70), DPPXHK_10CL010_SDRAM (U25.12)
FMU_I2C1_SCL: DPPXHK_MCU (U11.95), DPPXHK_FMU_PORTS_CAN (J1.13 R3.2)
FMU_I2C1_SDA: DPPXHK_MCU (U11.96), DPPXHK_FMU_PORTS_CAN (J1.14 R4.2)
FMU_I2C2_SCL: DPPXHK_MCU (U11.47), DPPXHK_USB_SD_DEBUG (R50.1), DPPXHK_LEDs (U9.3)
FMU_I2C2_SDA: DPPXHK_MCU (U11.48), DPPXHK_USB_SD_DEBUG (R51.1), DPPXHK_LEDs (U9.2)
FMU_LED_AMBER: DPPXHK_MCU (U11.43), DPPXHK_LEDs (R21.1)
FMU_SWCLK: DPPXHK_MCU (U11.76), DPPXHK_FMU_PORTS_CAN (P1.6)
FMU_SWDIO: DPPXHK_MCU (U11.72), DPPXHK_FMU_PORTS_CAN (P1.5)
FMU_UART4_RX: DPPXHK_MCU (U11.24), DPPXHK_FMU_PORTS_CAN (J1.28)
FMU_UART4_TX: DPPXHK_MCU (U11.23), DPPXHK_FMU_PORTS_CAN (J1.27)
FMU_UART7_RX: DPPXHK_MCU (U11.38), DPPXHK_FMU_PORTS_CAN (J1.32)
FMU_UART7_TX: DPPXHK_MCU (U11.39), DPPXHK_FMU_PORTS_CAN (J1.31)
FMU_UART8_RX: DPPXHK_MCU (U11.97), DPPXHK_FMU_PORTS_CAN (J1.30)
FMU_UART8_TX: DPPXHK_MCU (U11.98), DPPXHK_FMU_PORTS_CAN (J1.29)
FMU_USART2_CTS: DPPXHK_MCU (U11.84), DPPXHK_FMU_PORTS_CAN (J1.19)
FMU_USART2_RTS: DPPXHK_MCU (U11.85), DPPXHK_FMU_PORTS_CAN (J1.20)
FMU_USART2_RX: DPPXHK_MCU (U11.87), DPPXHK_FMU_PORTS_CAN (J1.22)
FMU_USART2_TX: DPPXHK_MCU (U11.86), DPPXHK_FMU_PORTS_CAN (J1.21)
FMU_USART3_CTS: DPPXHK_MCU (U11.58), DPPXHK_FMU_PORTS_CAN (J1.23)
FMU_USART3_RTS: DPPXHK_MCU (U11.59), DPPXHK_FMU_PORTS_CAN (J1.24)
FMU_USART3_RX: DPPXHK_MCU (U11.56), DPPXHK_FMU_PORTS_CAN (J1.26)
FMU_USART3_TX: DPPXHK_MCU (U11.55), DPPXHK_FMU_PORTS_CAN (J1.25)
FPGA_RESET: DPPXHK_10CL010_FPGA (U21.1), DPPXHK_10CL010_DEBUGPORT (R63.1)
FPGA_SDIO_CK: DPPXHK_10CL010_FPGA (U21.114), DPPXHK_10CL010_GRAPHICS (P6.5)
FPGA_SDIO_CMD: DPPXHK_10CL010_FPGA (U21.113), DPPXHK_10CL010_GRAPHICS (P6.3 R76.1)
FPGA_SDIO_D0: DPPXHK_10CL010_FPGA (U21.115), DPPXHK_10CL010_GRAPHICS (P6.7 R75.1)
FPGA_SDIO_D1: DPPXHK_10CL010_FPGA (U21.119), DPPXHK_10CL010_GRAPHICS (P6.8 R74.1)
FPGA_SDIO_D2: DPPXHK_10CL010_FPGA (U21.111), DPPXHK_10CL010_GRAPHICS (P6.1 R78.1)
FPGA_SDIO_D3: DPPXHK_10CL010_FPGA (U21.112), DPPXHK_10CL010_GRAPHICS (P6.2 R77.1)
GPIO_EXT_1: DPPXHK_MCU (U11.8), DPPXHK_FMU_PORTS_CAN (J1.7)
GREEN: DPPXHK_10CL010_DEBUGPORT (P7.2), DPPXHK_10CL010_GRAPHICS (7 pins)
GYRO_CS: DPPXHK_MCU (U11.7), DPPXHK_SENSOR (U13.5), DPPXHK_10CL010_FPGA (U21.28)
GYRO_DRDY: DPPXHK_MCU (U11.35), DPPXHK_SENSOR (U13.6), DPPXHK_10CL010_FPGA (U21.31)
IO_CH1: DPPXHK_IO (U5.10), DPPXHK_SERVO (J2.28)
IO_CH2: DPPXHK_IO (U5.11), DPPXHK_SERVO (J2.25)
IO_CH3: DPPXHK_IO (U5.45), DPPXHK_SERVO (J2.22)
IO_CH4: DPPXHK_IO (U5.46), DPPXHK_SERVO (J2.19)
IO_CH5: DPPXHK_IO (U5.16), DPPXHK_SERVO (J2.16)
IO_CH6: DPPXHK_IO (U5.17), DPPXHK_SERVO (J2.13)
IO_CH7: DPPXHK_IO (U5.18), DPPXHK_SERVO (J2.10)
IO_CH8: DPPXHK_IO (U5.19), DPPXHK_SERVO (J2.7)
IO_CLK_24M: DPPXHK_MCU (R34.2), DPPXHK_IO (U5.5)
IO_LED_AMBER: DPPXHK_IO (U5.28), DPPXHK_LEDs (R24.1)
IO_LED_BLUE: DPPXHK_IO (U5.27), DPPXHK_LEDs (R25.1)
IO_LED_SAFETY: DPPXHK_IO (U5.26), DPPXHK_LEDs (R8.1)
IO_SWCLK: DPPXHK_IO (U5.37), DPPXHK_FMU_PORTS_CAN (P1.4)
IO_SWDIO: DPPXHK_IO (U5.34), DPPXHK_FMU_PORTS_CAN (P1.3)
IO_USART1_RX: DPPXHK_IO (U5.31), DPPXHK_FMU_PORTS_CAN (J1.16)
IO_USART1_TX: DPPXHK_MCU (R31.1), DPPXHK_IO (U5.30), DPPXHK_FMU_PORTS_CAN (J1.15)
MAG_DRDY: DPPXHK_MCU (U11.36), DPPXHK_SENSOR (U16.9), DPPXHK_10CL010_FPGA (U21.51)
MPU_CS: DPPXHK_MCU (U11.17), DPPXHK_SENSOR (U14.8), DPPXHK_10CL010_FPGA (U21.52)
MPU_DRDY: DPPXHK_MCU (U11.62), DPPXHK_SENSOR (U14.12), DPPXHK_10CL010_FPGA (U21.53)
nCE: DPPXHK_10CL010_FPGA (R70.2 U21.21), DPPXHK_10CL010_DEBUGPORT (P5.11)
nCONFIG: DPPXHK_10CL010_FPGA (R66.2 U21.14), DPPXHK_10CL010_DEBUGPORT (P5.6)
nCSO: DPPXHK_10CL010_FPGA (R64.2 U21.8), DPPXHK_10CL010_DEBUGPORT (P5.2 U20.1)
nSTATUS: DPPXHK_10CL010_FPGA (R65.2 U21.9), DPPXHK_10CL010_DEBUGPORT (P5.3)
NXT: DPPXHK_10CL010_FPGA (U21.69), DPPXHK_10CL010_SDRAM (U25.11)
OTG_FS_DM: DPPXHK_MCU (U11.70), DPPXHK_USB_SD_DEBUG (J3.2 U19.4)
OTG_FS_DP: DPPXHK_MCU (U11.71), DPPXHK_USB_SD_DEBUG (J3.3 U19.6)
OV_D0: DPPXHK_10CL010_FPGA (U21.85), DPPXHK_10CL010_GRAPHICS (J4.9)
OV_D1: DPPXHK_10CL010_FPGA (U21.89), DPPXHK_10CL010_GRAPHICS (J4.10)
OV_D2: DPPXHK_10CL010_FPGA (U21.90), DPPXHK_10CL010_GRAPHICS (J4.11)
OV_D3: DPPXHK_10CL010_FPGA (U21.91), DPPXHK_10CL010_GRAPHICS (J4.12)
OV_D4: DPPXHK_10CL010_FPGA (U21.98), DPPXHK_10CL010_GRAPHICS (J4.13)
OV_D5: DPPXHK_10CL010_FPGA (U21.99), DPPXHK_10CL010_GRAPHICS (J4.14)
OV_D6: DPPXHK_10CL010_FPGA (U21.106), DPPXHK_10CL010_GRAPHICS (J4.15)
OV_D7: DPPXHK_10CL010_FPGA (U21.105), DPPXHK_10CL010_GRAPHICS (J4.16)
OV_HREF: DPPXHK_10CL010_FPGA (U21.80), DPPXHK_10CL010_GRAPHICS (J4.6)
OV_PCLK: DPPXHK_10CL010_FPGA (U21.83), DPPXHK_10CL010_GRAPHICS (J4.7)
OV_PWDN: DPPXHK_10CL010_FPGA (U21.84), DPPXHK_10CL010_GRAPHICS (J4.8)
OV_RESET: DPPXHK_10CL010_FPGA (U21.76), DPPXHK_10CL010_GRAPHICS (J4.3)
OV_SCL: DPPXHK_10CL010_FPGA (U21.101), DPPXHK_10CL010_GRAPHICS (J4.17)
OV_SDA: DPPXHK_10CL010_FPGA (U21.100), DPPXHK_10CL010_GRAPHICS (J4.18)
OV_VSYNC: DPPXHK_10CL010_FPGA (U21.77), DPPXHK_10CL010_GRAPHICS (J4.4)
POWIO_Cur: DPPXHK_POWER_SOURCE (R38.1 R40.2), DPPXHK_FMU_PORTS_CAN (J1.4)
POWIO_Vol: DPPXHK_POWER_SOURCE (R39.1 R41.2), DPPXHK_FMU_PORTS_CAN (J1.3)
PPM_INPUT: DPPXHK_IO (U5.29), DPPXHK_SERVO (R48.2 U18.2)
RED: DPPXHK_10CL010_DEBUGPORT (P7.1), DPPXHK_10CL010_GRAPHICS (6 pins)
RSSI_IN: DPPXHK_IO (U5.15 U5.33), DPPXHK_SERVO (R49.1)
SAFETY: DPPXHK_IO (U5.41), DPPXHK_LEDs (S1.1), DPPXHK_FMU_PORTS_CAN (J1.10 R5.2)
SBUS_INPUT: DPPXHK_IO (U5.22), DPPXHK_SERVO (U18.6)
SBUS_OUTPUT: DPPXHK_IO (U5.21), DPPXHK_SERVO (U18.5)
SDIO_CK: DPPXHK_MCU (U11.80), DPPXHK_USB_SD_DEBUG (P4.5)
SDIO_CMD: DPPXHK_MCU (U11.83), DPPXHK_USB_SD_DEBUG (P4.3 R54.1)
SDIO_D0: DPPXHK_MCU (U11.65), DPPXHK_USB_SD_DEBUG (P4.7 R53.1)
SDIO_D1: DPPXHK_MCU (U11.66), DPPXHK_USB_SD_DEBUG (P4.8 R52.1)
SDIO_D2: DPPXHK_MCU (U11.78), DPPXHK_USB_SD_DEBUG (P4.1 R56.1)
SDIO_D3: DPPXHK_MCU (U11.79), DPPXHK_USB_SD_DEBUG (P4.2 R55.1)
SERIAL_FMU_TO_IO: DPPXHK_MCU (U11.63), DPPXHK_IO (R16.2)
SERIAL_IO_TO_FMU: DPPXHK_MCU (U11.64), DPPXHK_IO (R15.2)
SPI_EXT_MISO: DPPXHK_MCU (U11.4), DPPXHK_FMU_PORTS_CAN (J1.12)
SPI_EXT_MOSI: DPPXHK_MCU (U11.5), DPPXHK_FMU_PORTS_CAN (J1.17)
SPI_EXT_NSS: DPPXHK_MCU (U11.3), DPPXHK_FMU_PORTS_CAN (J1.18)
SPI_EXT_SCK: DPPXHK_MCU (U11.1), DPPXHK_FMU_PORTS_CAN (J1.11)
SPI_INT_MISO: DPPXHK_MCU (U11.31), DPPXHK_SENSOR (U13.4 U14.9 U15.6 U16.7), DPPXHK_10CL010_FPGA (U21.42)
SPI_INT_MOSI: DPPXHK_MCU (U11.32), DPPXHK_SENSOR (U13.3 U14.24 U15.7 U16.6), DPPXHK_10CL010_FPGA (U21.39)
SPI_INT_SCK: DPPXHK_MCU (U11.30), DPPXHK_SENSOR (U13.2 U14.23 U15.8 U16.4), DPPXHK_10CL010_FPGA (U21.38)
STP: DPPXHK_10CL010_FPGA (U21.68), DPPXHK_10CL010_SDRAM (U25.13)
TCK: DPPXHK_10CL010_FPGA (R68.2 U21.16), DPPXHK_10CL010_DEBUGPORT (P5.8)
TDI: DPPXHK_10CL010_FPGA (R67.2 U21.15), DPPXHK_10CL010_DEBUGPORT (P5.7)
TDO: DPPXHK_10CL010_FPGA (U21.20), DPPXHK_10CL010_DEBUGPORT (P5.10)
TMS: DPPXHK_10CL010_FPGA (R69.2 U21.18), DPPXHK_10CL010_DEBUGPORT (P5.9)
VDD_5V_SENS: DPPXHK_MCU (U11.29), DPPXHK_FMUPOWER (R13.2 R14.1)
VGA_HSYNC: DPPXHK_10CL010_FPGA (U21.143), DPPXHK_10CL010_DEBUGPORT (P7.4)
VGA_VSYNC: DPPXHK_10CL010_FPGA (U21.144), DPPXHK_10CL010_DEBUGPORT (P7.5)
VGAD0: DPPXHK_10CL010_FPGA (U21.142), DPPXHK_10CL010_GRAPHICS (RN12.5)
VGAD1: DPPXHK_10CL010_FPGA (U21.138), DPPXHK_10CL010_GRAPHICS (RN11.7)
VGAD2: DPPXHK_10CL010_FPGA (U21.141), DPPXHK_10CL010_GRAPHICS (RN11.5)
VGAD3: DPPXHK_10CL010_FPGA (U21.136), DPPXHK_10CL010_GRAPHICS (RN10.7)
VGAD4: DPPXHK_10CL010_FPGA (U21.137), DPPXHK_10CL010_GRAPHICS (RN10.5 RN10.6)
VGAD5: DPPXHK_10CL010_FPGA (U21.135), DPPXHK_10CL010_GRAPHICS (RN8.5)
VGAD6: DPPXHK_10CL010_FPGA (U21.133), DPPXHK_10CL010_GRAPHICS (RN7.5)
VGAD7: DPPXHK_10CL010_FPGA (U21.129), DPPXHK_10CL010_GRAPHICS (RN6.7)
VGAD8: DPPXHK_10CL010_FPGA (U21.132), DPPXHK_10CL010_GRAPHICS (RN6.5)
VGAD9: DPPXHK_10CL010_FPGA (U21.127), DPPXHK_10CL010_GRAPHICS (RN5.7)
VGAD10: DPPXHK_10CL010_FPGA (U21.128), DPPXHK_10CL010_GRAPHICS (RN5.5 RN5.6)
VGAD11: DPPXHK_10CL010_FPGA (U21.126), DPPXHK_10CL010_GRAPHICS (RN4.5)
VGAD12: DPPXHK_10CL010_FPGA (U21.124), DPPXHK_10CL010_GRAPHICS (RN3.7)
VGAD13: DPPXHK_10CL010_FPGA (U21.125), DPPXHK_10CL010_GRAPHICS (RN3.5)
VGAD14: DPPXHK_10CL010_FPGA (U21.120), DPPXHK_10CL010_GRAPHICS (RN2.7)
VGAD15: DPPXHK_10CL010_FPGA (U21.121), DPPXHK_10CL010_GRAPHICS (RN2.5 RN2.6)